# Altium project RTU v1.4.PrjPcb (part 1 of 2)
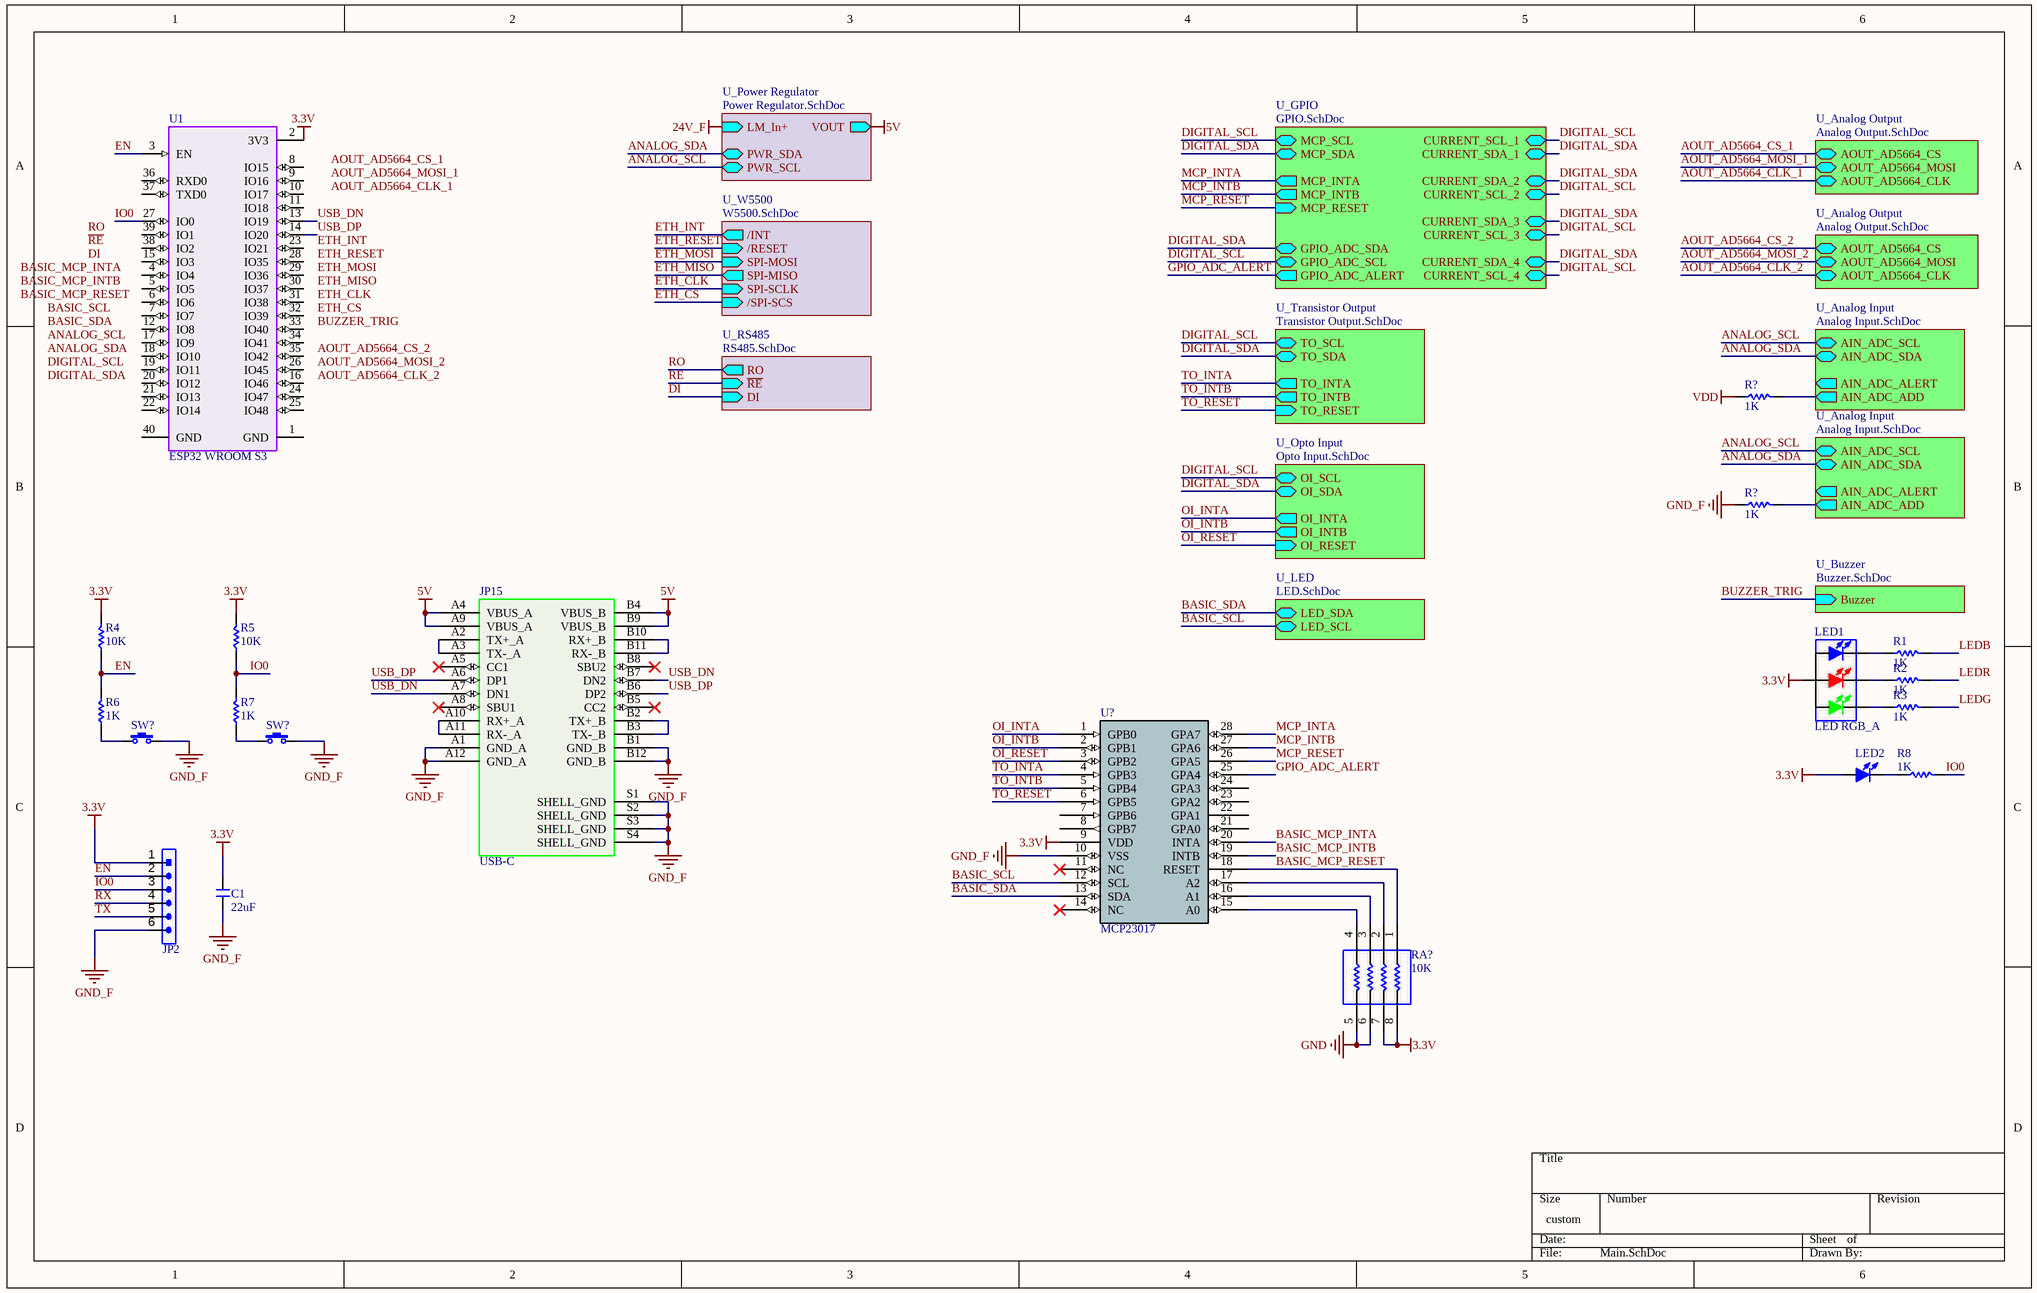
[diagram p0: Main.SchDoc]
12 sheets, 494 parts. Net scope: hierarchical (ports join the sheet entries above them; power ports are global).
Board file: RTU PCB v1.4.PcbDoc
Sheets:
  Main.SchDoc
    U_RS485 = RS485.SchDoc
    U_Power Regulator = Power Regulator.SchDoc
    U_W5500 = W5500.SchDoc
    U_Analog Input = Analog Input.SchDoc
    U_Analog Input = Analog Input.SchDoc
    U_Analog Output = Analog Output.SchDoc
    U_Analog Output = Analog Output.SchDoc
    U_Transistor Output = Transistor Output.SchDoc
    U_GPIO = GPIO.SchDoc
      U_GPIO SUB = GPIO SUB.SchDoc
      U_GPIO SUB = GPIO SUB.SchDoc
      U_GPIO SUB = GPIO SUB.SchDoc
      U_GPIO SUB = GPIO SUB.SchDoc
    U_Opto Input = Opto Input.SchDoc
    U_Buzzer = Buzzer.SchDoc
    U_LED = LED.SchDoc

## Sheet Main.SchDoc
size 381 x 241 mm; SheetNumber: 1; SheetTotal: 11

### Parts
(Parts that share a designator on the sheet are numbered #1, #2 ... from top to bottom, then left to right.)
C1  22uF  [C 0805]
JP2  HDR-1X6  [HDR-1X6]  (value not drawn)
JP15  USB-C  [USB-C-RIGHT]
LED1  LED RGB_A  [RGB-0805-A]
LED2  LED-SMD  [LED 0805B]  (value not drawn)
R1  1K  [R 0805]
R2  1K  [R 0805]
R3  1K  [R 0805]
R4  10K  [R 0805]
R5  10K  [R 0805]
R6  1K  [R 0805]
R7  1K  [R 0805]
R8  1K  [R 0805]
R?#1  1K  [R 0805]
R?#2  1K  [R 0805]
RA?#1  10K  [RA1206 (4x0603)]
SW?#1  SKPMAPE010-6X6  [SKPMAPE010]  (value not drawn)
SW?#2  SKPMAPE010-6X6  [SKPMAPE010]  (value not drawn)
U1  ESP32 WROOM S3  [ESP32 WROOM S3]
U?#1  MCP23017  [SOIC28]

### Sub-sheets
U_Analog Input = Analog Input.SchDoc: AIN_ADC_SCL (bidir), AIN_ADC_SDA (bidir), AIN_ADC_ALERT (out), AIN_ADC_ADD (out)
U_Analog Input = Analog Input.SchDoc: AIN_ADC_SCL (bidir), AIN_ADC_SDA (bidir), AIN_ADC_ALERT (out), AIN_ADC_ADD (out)
U_Analog Output = Analog Output.SchDoc: AOUT_AD5664_CS (bidir), AOUT_AD5664_MOSI (bidir), AOUT_AD5664_CLK (bidir)
U_Analog Output = Analog Output.SchDoc: AOUT_AD5664_CS (bidir), AOUT_AD5664_MOSI (bidir), AOUT_AD5664_CLK (bidir)
U_Buzzer = Buzzer.SchDoc: Buzzer (in)
U_GPIO = GPIO.SchDoc: GPIO_ADC_ALERT (out), MCP_INTA (out), MCP_INTB (out), MCP_RESET (in), MCP_SCL (bidir), MCP_SDA (bidir), CURRENT_SCL_1 (bidir), CURRENT_SDA_1 (bidir), CURRENT_SDA_2 (bidir), CURRENT_SCL_2 (bidir), CURRENT_SDA_4 (bidir), CURRENT_SCL_4 (bidir), CURRENT_SDA_3 (bidir), CURRENT_SCL_3 (bidir), GPIO_ADC_SDA (bidir), GPIO_ADC_SCL (bidir)
U_LED = LED.SchDoc: LED_SDA (bidir), LED_SCL (bidir)
U_Opto Input = Opto Input.SchDoc: OI_SCL (bidir), OI_SDA (bidir), OI_INTA (out), OI_INTB (out), OI_RESET (in)
U_Power Regulator = Power Regulator.SchDoc: LM_In+ (in), VOUT (out), PWR_SCL (bidir), PWR_SDA (bidir)
U_RS485 = RS485.SchDoc: RO (out), ~{RE} (in), DI (in)
U_Transistor Output = Transistor Output.SchDoc: TO_SCL (bidir), TO_SDA (bidir), TO_INTA (out), TO_INTB (out), TO_RESET (in)
U_W5500 = W5500.SchDoc: /INT (out), /RESET (in), SPI-MOSI (in), SPI-MISO (out), SPI-SCLK (in), /SPI-SCS (in)

### Nets
3.3V: C1.1 JP2.1 LED1.3(RED_A) LED2.1(A) R4.2 R5.2 RA?#1.7 RA?#1.8 U1.2(3V3) U?#1.9(VDD)
5V: JP15.A4(VBUS_A) JP15.A9(VBUS_A) JP15.B4(VBUS_B) JP15.B9(VBUS_B) ; sheet U_Power Regulator/VOUT  [project net VOUT]
GND: RA?#1.5 RA?#1.6
GND_F: C1.2 JP2.6 JP15.A1(GND_A) JP15.A12(GND_A) JP15.B1(GND_B) JP15.B12(GND_B) JP15.S1(SHELL_GND) JP15.S2(SHELL_GND) JP15.S3(SHELL_GND) JP15.S4(SHELL_GND) R?#2.1 SW?#1.2 SW?#2.2 U?#1.10(VSS)
VDD: R?#1.1
ANALOG_SCL: sheet U_Power Regulator/PWR_SCL, sheet U_Analog Input/AIN_ADC_SCL, sheet U_Analog Input/AIN_ADC_SCL
ANALOG_SDA: sheet U_Power Regulator/PWR_SDA, sheet U_Analog Input/AIN_ADC_SDA, sheet U_Analog Input/AIN_ADC_SDA
BASIC_MCP_INTA: U?#1.20(INTA)
BASIC_MCP_INTB: U?#1.19(INTB)
BASIC_MCP_RESET: RA?#1.1 U?#1.18(RESET)
BASIC_SCL: U?#1.12(SCL) ; sheet U_LED/LED_SCL
BASIC_SDA: U?#1.13(SDA) ; sheet U_LED/LED_SDA
DIGITAL_SCL: sheet U_Transistor Output/TO_SCL, sheet U_GPIO/MCP_SCL, sheet U_GPIO/CURRENT_SCL_1, sheet U_GPIO/CURRENT_SCL_2, sheet U_GPIO/CURRENT_SCL_4, sheet U_GPIO/CURRENT_SCL_3, sheet U_GPIO/GPIO_ADC_SCL, sheet U_Opto Input/OI_SCL
DIGITAL_SDA: sheet U_Transistor Output/TO_SDA, sheet U_GPIO/MCP_SDA, sheet U_GPIO/CURRENT_SDA_1, sheet U_GPIO/CURRENT_SDA_2, sheet U_GPIO/CURRENT_SDA_4, sheet U_GPIO/CURRENT_SDA_3, sheet U_GPIO/GPIO_ADC_SDA, sheet U_Opto Input/OI_SDA
EN: JP2.2 R4.1 R6.2 U1.3(EN)
GPIO_ADC_ALERT: U?#1.25(GPA4) ; sheet U_GPIO/GPIO_ADC_ALERT
IO0: JP2.3 R5.1 R7.2 R8.2 U1.27(IO0)
LEDB: R1.2
LEDG: R3.2
LEDR: R2.2
MCP_INTA: U?#1.28(GPA7) ; sheet U_GPIO/MCP_INTA
MCP_INTB: U?#1.27(GPA6) ; sheet U_GPIO/MCP_INTB
MCP_RESET: U?#1.26(GPA5) ; sheet U_GPIO/MCP_RESET
OI_INTA: U?#1.1(GPB0) ; sheet U_Opto Input/OI_INTA
OI_INTB: U?#1.2(GPB1) ; sheet U_Opto Input/OI_INTB
OI_RESET: U?#1.3(GPB2) ; sheet U_Opto Input/OI_RESET
RX: JP2.4
TO_INTA: U?#1.4(GPB3) ; sheet U_Transistor Output/TO_INTA
TO_INTB: U?#1.5(GPB4) ; sheet U_Transistor Output/TO_INTB
TO_RESET: U?#1.6(GPB5) ; sheet U_Transistor Output/TO_RESET
TX: JP2.5
USB_DN: JP15.A7(DN1) JP15.B7(DN2) U1.13(IO19)
USB_DP: JP15.A6(DP1) JP15.B6(DP2) U1.14(IO20)
NetJP15_A2: JP15.A2(TX+_A) JP15.A3(TX-_A)
NetJP15_A10: JP15.A10(RX+_A) JP15.A11(RX-_A)
NetJP15_B2: JP15.B2(TX+_B) JP15.B3(TX-_B)
NetJP15_B10: JP15.B10(RX+_B) JP15.B11(RX-_B)
NetLED1_1: LED1.1(BULE_K) R1.1
NetLED1_2: LED1.2(GREEN_K) R3.1
NetLED1_4: LED1.4(RED_K) R2.1
NetLED2_2: LED2.2(K) R8.1
NetR6_1: R6.1 SW?#1.1
NetR7_1: R7.1 SW?#2.1
NetR?#1_2: R?#1.2 ; sheet U_Analog Input/AIN_ADC_ADD
NetR?#2_2: R?#2.2 ; sheet U_Analog Input/AIN_ADC_ADD
NetRA?#1_2: RA?#1.2 U?#1.17(A2)
NetRA?#1_3: RA?#1.3 U?#1.16(A1)
NetRA?#1_4: RA?#1.4 U?#1.15(A0)

Not connected (* = marked no-connect by the designer): JP15 A5(CC1)* A8(SBU1)* B5(CC2)* B8(SBU2)*; U1 1(GND) 4(IO4) 5(IO5) 6(IO6) 7(IO7) 8(IO15) 9(IO16) 10(IO17) 11(IO18) 12(IO8) 15(IO3) 16(IO46) 17(IO9) 18(IO10) 19(IO11) 20(IO12) 21(IO13) 22(IO14) 23(IO21) 24(IO47) 25(IO48) 26(IO45) 28(IO35) 29(IO36) 30(IO37) 31(IO38) 32(IO39) 33(IO40) 34(IO41) 35(IO42) 36(RXD0) 37(TXD0) 38(IO2) 39(IO1) 40(GND); U?#1 7(GPB6) 8(GPB7) 11(NC)* 14(NC)* 21(GPA0) 22(GPA1) 23(GPA2) 24(GPA3)

### Notes on the sheet
- Labels drawn without touching a wire or pin: ANALOG_SCL, ANALOG_SDA, AOUT_AD5664_CLK_1, AOUT_AD5664_CLK_2, AOUT_AD5664_CS_1, AOUT_AD5664_CS_2, AOUT_AD5664_MOSI_1, AOUT_AD5664_MOSI_2, BASIC_MCP_INTA, BASIC_MCP_INTB, BASIC_MCP_RESET, BASIC_SCL, BASIC_SDA, BUZZER_TRIG, DI, DIGITAL_SCL, DIGITAL_SDA, ETH_CLK, ETH_CS, ETH_INT, ETH_MISO, ETH_MOSI, ETH_RESET, RO, ~{RE}

### Library data of the parts
C1 = C: Non-polar patch capacitor; BOM名称: 无极性贴片电容; 版权归属: 源创客; 学习资源: www.ooocke.com
JP2 = Header 6: 6P Connector; BOM名称: 6P接插件; 版权归属: 源创客; 学习资源: www.ooocke.com
JP15 = USB-C-RIGHT
LED2 = LED-SMD: Patch LED; BOM名称: 贴片LED; 版权归属: 源创客; 学习资源: www.ooocke.com
R1-R8 R?#1 R?#2 = R: Chip resistor; 版权归属: 源创客; BOM名称: Chip resistor; 学习资源: www.ooocke.com
RA?#1 = R-ARR: 4 way Chip Resistor Array
SW?#1 SW?#2 = SKPMAPE010-6X6: Carbon Tactile

## Sheet RS485.SchDoc
size A4; SheetNumber: 7; SheetTotal: 8
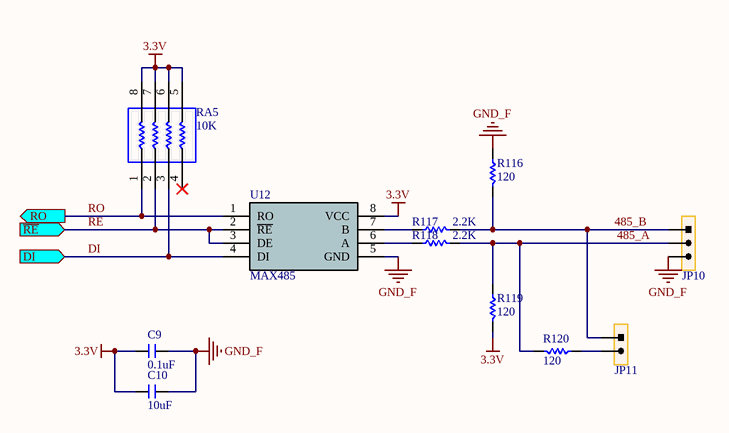
[diagram p1: RS485.SchDoc]

### Parts
C9  0.1uF  [C 0805]
C10  10uF  [C 0805]
JP10  HDR-1X3  [KF2EDGK-3P_H_5.08]  (value not drawn)
JP11  HDR-1X2  [HDR-1X2]  (value not drawn)
R116  120  [R 0805]
R117  2.2K  [R 0805]
R118  2.2K  [R 0805]
R119  120  [R 0805]
R120  120  [R 0805]
RA5  10K  [RA1206 (4x0603)]
U12  MAX485  [SOP8_N]

### Ports
DI (in), RO (out), ~{RE} (in)

### Nets
3.3V: C9.1 C10.1 R119.2 RA5.5 RA5.6 RA5.7 RA5.8 U12.8(VCC)
GND_F: C9.2 C10.2 JP10.3 R116.1 U12.5(GND)
485_A: JP10.2 R118.2 R119.1 R120.2
485_B: JP10.1 JP11.1 R116.2 R117.2
DI: RA5.3 U12.4(DI) ; port DI
~{RE}: RA5.2 U12.2(~{RE}) U12.3(DE) ; port ~{RE}
RO: RA5.1 U12.1(RO) ; port RO
NetJP11_2: JP11.2 R120.1
NetR117_1: R117.1 U12.7(B)
NetR118_1: R118.1 U12.6(A)

Not connected (* = marked no-connect by the designer): RA5 4*

### Library data of the parts
C9 C10 = C: as C1 on sheet Main; 学习资源: www.ooocke.com
JP10 = Header 3: 3P Connector; BOM名称: 3P接插件; 版权归属: 源创客; 学习资源: www.ooocke.com
JP11 = Header 2: 2P Connector; BOM名称: 2P接插件; 版权归属: 源创客; 学习资源: www.ooocke.com
R116-R120 = R: Chip resistor; 版权归属: 源创客; BOM名称: Chip resistor; 学习资源: www.ooocke.com
RA5 = R-ARR: 4 way Chip Resistor Array
U12 = MAX485: RS485/RS422 Transceivers; BOM名称: MAX232; 版权归属: 源创客; 学习资源: www.ooocke.com

## Sheet Power Regulator.SchDoc
size A4; SheetNumber: 2; SheetTotal: 9
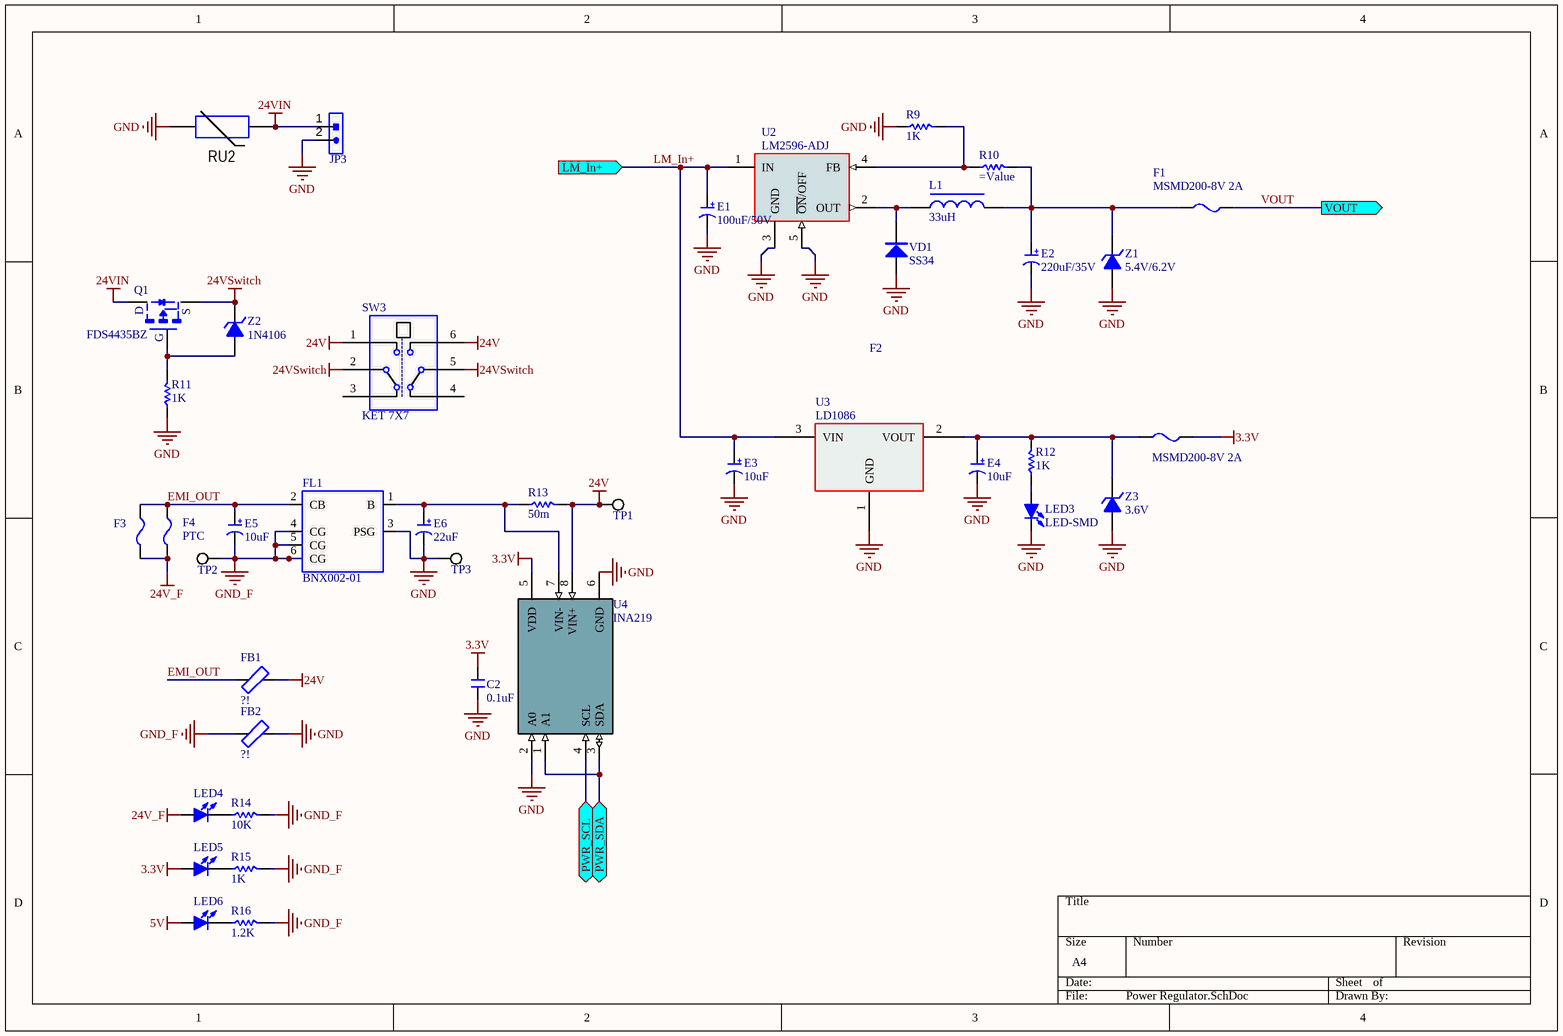
[diagram p2: Power Regulator.SchDoc]

### Parts
C2  0.1uF  [C 0805]
E1  100uF/50V  [CM C(5*5.4)]
E2  220uF/35V  [CM C(5*5.4)]
E3  10uF  [CM C(5*5.4)]
E4  10uF  [CM C(5*5.4)]
E5  10uF  [CM D(6.3*7.7)]
E6  22uF  [CM D(6.3*7.7)]
F1  MSMD200-8V 2A  [FU 0805]
F2  MSMD200-8V 2A  [FU 0805]
F3  MSMD200-8V 2A  [FU 1206]  (value not drawn)
F4  PTC  [PTC]
FB1  ?!  [F 1206]
FB2  ?!  [F 1206]
FL1  BNX002-01  [FIL_BNX002-01]
JP3  HDR-1X2  [KF2EDGK-2P_H_7.62]  (value not drawn)
L1  33uH  [CD53]
LED3  LED-SMD  [LED 0805R]
LED4  LED-SMD  [LED 0805R]  (value not drawn)
LED5  LED-SMD  [LED 0805R]  (value not drawn)
LED6  LED-SMD  [LED 0805R]  (value not drawn)
Q1  FDS4435BZ  [SOP8-E3]
R9  1K  [R 0805]
R10  (no value)  [R 0805]
R11  1K  [R 0805]
R12  1K  [R 0805]
R13  50m  [R 1812]
R14  10K  [R 0805]
R15  1K  [R 0805]
R16  1.2K  [R 0805]
RU2  *  [Varistor Short Hieght - Straight]  (value not drawn)
SW3  KET 7X7  [KFT DIP-7X7]
TP1  Test Point Pad  [TP15]  (value not drawn)
TP2  Test Point Pad  [TP15]  (value not drawn)
TP3  Test Point Pad  [TP15]  (value not drawn)
U2  LM2596-ADJ  [TO263-5A]
U3  LD1086  [TO252]
U4  INA219  [SOT23-8]
VD1  SS34  [SMA]
Z1  5.4V/6.2V  [DO-213AA]
Z2  1N4106  [DO-213AA]
Z3  3.6V  [DO-213AA]

### Ports
LM_In+ (in), PWR_SCL (bidir), PWR_SDA (bidir), VOUT (out)

### Nets
3.3V: C2.2 F2.2 LED5.1(A) U4.5(VDD)
24V: FB1.2 R13.2 SW3.1 SW3.6 TP1.1 U4.8(VIN+)
24VIN: JP3.1 Q1.5-8(D) RU2.2
24VSwitch: Q1.1-3(S) SW3.2 SW3.5 Z2.2(K)
GND: C2.1 E1.2(K) E2.2(K) E3.2(K) E4.2(K) E6.2(K) FB2.2 FL1.3(PSG) JP3.2 LED3.2(K) R9.1 R11.1 RU2.1 TP3.1 U2.3(GND) U2.5(~{ON}/OFF) U3.1(GND) U4.2(A0) U4.6(GND) VD1.1(A) Z1.1(A) Z3.1(A)
GND_F: E5.2(K) FB2.1 FL1.4(CG) FL1.5(CG) FL1.6(CG) R14.2 R15.2 R16.2 TP2.1
LM_In+: E1.1(A) E3.1(A) F3.1 F4.1 LED4.1(A) U2.1(IN) U3.3(VIN) ; port LM_In+  [also labelled 24V_F]
VOUT: F1.2 LED6.1(A) ; port VOUT  [also labelled 5V]
ANALOG_SCL: U4.4(SCL) ; port PWR_SCL
ANALOG_SDA: U4.1(A1) U4.3(SDA) ; port PWR_SDA
EMI_OUT: E5.1(A) F3.2 F4.2 FB1.1 FL1.2(CB)
NetE2_1: E2.1(A) F1.1 L1.2 R10.2 Z1.2(K)
NetE4_1: E4.1(A) F2.1 R12.2 U3.2(VOUT) Z3.2(K)
NetE6_1: E6.1(A) FL1.1(B) R13.1 U4.7(VIN-)
NetL1_1: L1.1 U2.2(OUT) VD1.2(K)
NetLED3_1: LED3.1(A) R12.1
NetLED4_2: LED4.2(K) R14.1
NetLED5_2: LED5.2(K) R15.1
NetLED6_2: LED6.2(K) R16.1
NetQ1_4: Q1.4(G) R11.2 Z2.1(A)
NetR9_2: R9.2 R10.1 U2.4(FB)

Not connected (* = marked no-connect by the designer): SW3 3 4

### Notes on the sheet
- (in symbol C-CM) +
- (in symbol KET 7X7) ---------------

### Library data of the parts
C2 = C: as C1 on sheet Main; 学习资源: www.ooocke.com
E1-E6 = C-CM: Chip electrolytic capacitor; BOM名称: 贴片电解电容; 版权归属: 源创客; 学习资源: www.ooocke.com
F1-F3 = FU: Chip fuse; BOM名称: 贴片保险丝; 版权归属: 源创客; 学习资源: www.ooocke.com
FB1 FB2 = FB: Ferrite Bead; BOM名称: 贴片电阻; 版权归属: 源创客; 学习资源: www.ooocke.com
FL1 = BNX002-01: LC EMI Filter 5th Order Low Pass 2 Channel 10A Block, 4 Lead; MF: Murata; Package: Block-4 Murata; Price: None; SnapEDA_Link: https://www.snapeda.com/parts/BNX002-01/Murata%20Electronics%20North%20America/view-part/12269/?ref=snap; Availability: Unavailable; Value: *; MP: BNX002-01
JP3 = Header 2: 2P Connector; BOM名称: 2P接插件; 版权归属: 源创客; 学习资源: www.ooocke.com
L1 = L-CD: Chip power inductor; BOM名称: 功率电感; 版权归属: 源创客; 学习资源: www.ooocke.com
LED3-LED6 = LED-SMD: Patch LED; BOM名称: 贴片LED; 版权归属: 源创客; 学习资源: www.ooocke.com
R9-R16 = R: Chip resistor; 版权归属: 源创客; BOM名称: Chip resistor; 学习资源: www.ooocke.com
RU2 = V: Versiror; Manufacturer: *; Model: *; HelpURL: *; ComponentKind: *; Value: *
SW3 = KET 7X7: 7*7 switch; BOM名称: 7*7开关; 版权归属: 源创客; 学习资源: www.ooocke.com
TP1-TP3 = Test Point Pad: Company: SJ Libraries; Designer: Eng. Saeid Jorablo; Rule: UNIONINDEX=0|RULEKIND=ComponentClearance|NETSCOPE=AnyNet|LAYERKIND=SameLayer|NAME=Schematic Component Clearance Constraint|GAP=0mil|COLLISIONCHECKMODE=3|VERTICALGAP=0mil|SHOWDISTANCES=FALSE|UNIT=Imperial; Mounting Technology: Surface Mount\Through-Hole; ComponentLink1Description: Datasheet; Pin Count: 0; Update Date: 6/3/2012; Category: MISC; HelpURL: http://s3.picofile.com/file/7443264187/Coming_Soon_logo.gif
U2 = LM2596: DC step-down chip; BOM名称: DC稳压芯片; 版权归属: 源创客; 学习资源: www.ooocke.com
U3 = LD1086: Linear Voltage Regulator IC 1 Output 1.5A DPAK
VD1 = SS34: Schottky diodes; BOM名称: 肖特基二极管; 版权归属: 源创客; 属性: 40V/3A; 学习资源: www.ooocke.com
Z1-Z3 = 1N4106: 12V/0.5W voltage regulator; BOM名称: 12V/0.5W稳压管; 版权归属: 源创客; 学习资源: www.ooocke.com

## Sheet W5500.SchDoc
size A4; SheetNumber: 5; SheetTotal: 8
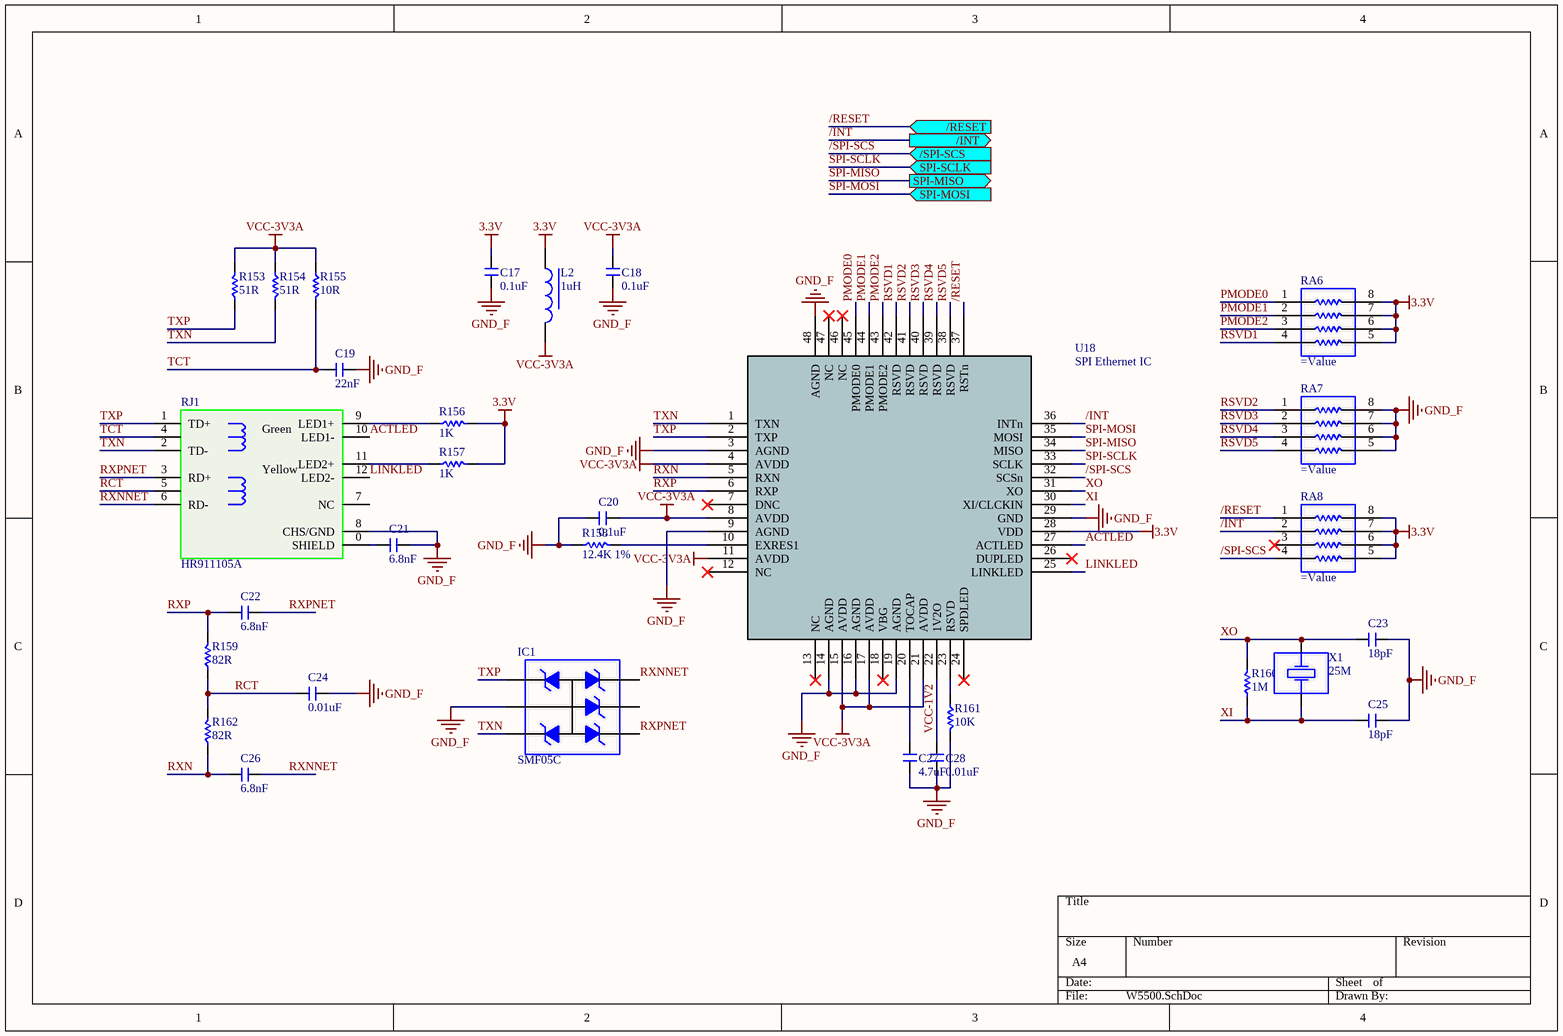
[diagram p3: W5500.SchDoc]

### Parts
C17  0.1uF  [C 0805]
C18  0.1uF  [C 0805]
C19  22nF  [C 0805]
C20  0.1uF  [C 0805]
C21  6.8nF  [C 0805]
C22  6.8nF  [C 0805]
C23  18pF  [C 0805]
C24  0.01uF  [C 0805]
C25  18pF  [C 0805]
C26  6.8nF  [C 0805]
C27  4.7uF  [C 0805]
C28  0.01uF  [C 0805]
IC1  SMF05C  [SOT23-6L]
L2  1uH  [L 0805]
R153  51R  [R 0805]
R154  51R  [R 0805]
R155  10R  [R 0805]
R156  1K  [R 0805]
R157  1K  [R 0805]
R158  12.4K 1%  [R 0805]
R159  82R  [R 0805]
R160  1M  [R 0805]
R161  10K  [R 0805]
R162  82R  [R 0805]
RA6  (no value)  [RA1206 (4x0603)]
RA7  (no value)  [RA1206 (4x0603)]
RA8  (no value)  [RA1206 (4x0603)]
RJ1  HR911105A  [RJ-45A12]
U18  SPI Ethernet IC  [LQFP48 7X7_L]
X1  25M  [XTAL-HC49S-THD]

### Ports
/INT (out), /RESET (in), /SPI-SCS (in), SPI-MISO (out), SPI-MOSI (in), SPI-SCLK (in)

### Nets
3.3V: C17.2 L2.1 R156.2 R157.2 RA6.5 RA6.6 RA6.7 RA6.8 RA8.5 RA8.6 RA8.7 RA8.8 U18.28(VDD)
GND_F: C17.1 C18.1 C19.2 C20.1 C21.2 C23.2 C24.2 C25.2 C27.2 C28.2 IC1.2(A) R158.1 R161.2 RA7.5 RA7.6 RA7.7 RA7.8 RJ1.8(CHS/GND) U18.3(AGND) U18.9(AGND) U18.14(AGND) U18.16(AGND) U18.19(AGND) U18.29(GND) U18.48(AGND)
VCC-3V3A: C18.2 C20.2 L2.2 R153.2 R154.1 R155.1 U18.4(AVDD) U18.8(AVDD) U18.11(AVDD) U18.15(AVDD) U18.17(AVDD) U18.21(AVDD)
/INT: RA8.2 U18.36(INTn) ; port /INT
/RESET: RA8.1 U18.37(RSTn) ; port /RESET
/SPI-SCS: RA8.4 U18.32(SCSn) ; port /SPI-SCS
ACTLED: RJ1.10(LED1-) U18.27(ACTLED)
LINKLED: RJ1.12(LED2-) U18.25(LINKLED)
PMODE0: RA6.1 U18.45(PMODE0)
PMODE1: RA6.2 U18.44(PMODE1)
PMODE2: RA6.3 U18.43(PMODE2)
RCT: C24.1 R159.1 R162.2 RJ1.5
RSVD1: RA6.4 U18.42(RSVD)
RSVD2: RA7.1 U18.41(RSVD)
RSVD3: RA7.2 U18.40(RSVD)
RSVD4: RA7.3 U18.39(RSVD)
RSVD5: RA7.4 U18.38(RSVD)
RXN: C26.1 R162.1 U18.5(RXN)
RXNNET: C26.2 IC1.4(K) RJ1.6(RD-)
RXP: C22.1 R159.2 U18.6(RXP)
RXPNET: C22.2 IC1.6(K) RJ1.3(RD+)
SPI-MISO: U18.34(MISO) ; port SPI-MISO  [project net ETH_MISO]
SPI-MOSI: U18.35(MOSI) ; port SPI-MOSI  [project net ETH_MOSI]
SPI-SCLK: U18.33(SCLK) ; port SPI-SCLK  [project net ETH_CLK]
TCT: C19.1 R155.2 RJ1.4
TXN: IC1.3(K) R154.2 RJ1.2(TD-) U18.1(TXN)
TXP: IC1.1(K) R153.1 RJ1.1(TD+) U18.2(TXP)
VCC-1V2: C28.1 U18.22(1V2O)
XI: C25.1 R160.1 U18.30(XI/CLCKIN) X1.1
XO: C23.1 R160.2 U18.31(XO) X1.2
NetC21_1: C21.1 RJ1.0(SHIELD)
NetC27_1: C27.1 U18.20(TOCAP)
NetR156_1: R156.1 RJ1.9(LED1+)
NetR157_1: R157.1 RJ1.11(LED2+)
NetR158_2: R158.2 U18.10(EXRES1)
NetR161_1: R161.1 U18.23(RSVD)

Not connected (* = marked no-connect by the designer): IC1 5(K); RA8 3*; RJ1 7(NC); U18 7(DNC)* 12(NC)* 13(NC)* 18(VBG)* 24(SPDLED)* 26(DUPLED)* 46(NC)* 47(NC)*

### Notes on the sheet
- (in symbol HR911105A) Green; Yellow

### Library data of the parts
C17-C28 = C: as C1 on sheet Main; 学习资源: www.ooocke.com
IC1 = SMF05C: ESD Protection Diode Array, 5-Line
L2 = L: Low power chip inductor; BOM名称: 小功率贴片电感; 版权归属: 源创客; 学习资源: www.ooocke.com
R153-R162 = R: Chip resistor; 版权归属: 源创客; BOM名称: Chip resistor; 学习资源: www.ooocke.com
RA6-RA8 = R-ARR: 4 way Chip Resistor Array
RJ1 = HR911105A: Illuminated Ethernet interface; BOM名称: 带灯以太网接口; 版权归属: 源创客; 学习资源: www.ooocke.com
U18 = W5500
X1 = XTAL-2: 2-Pin crystal; BOM名称: 2脚晶振; 版权归属: 源创客; 学习资源: www.ooocke.com

## Sheet Analog Input.SchDoc
size A4; SheetNumber: 6; SheetTotal: 10
Used 2 times, as channels U_Analog Input, U_Analog Input. Parts and nets are listed once, with the designators drawn on the sheet.
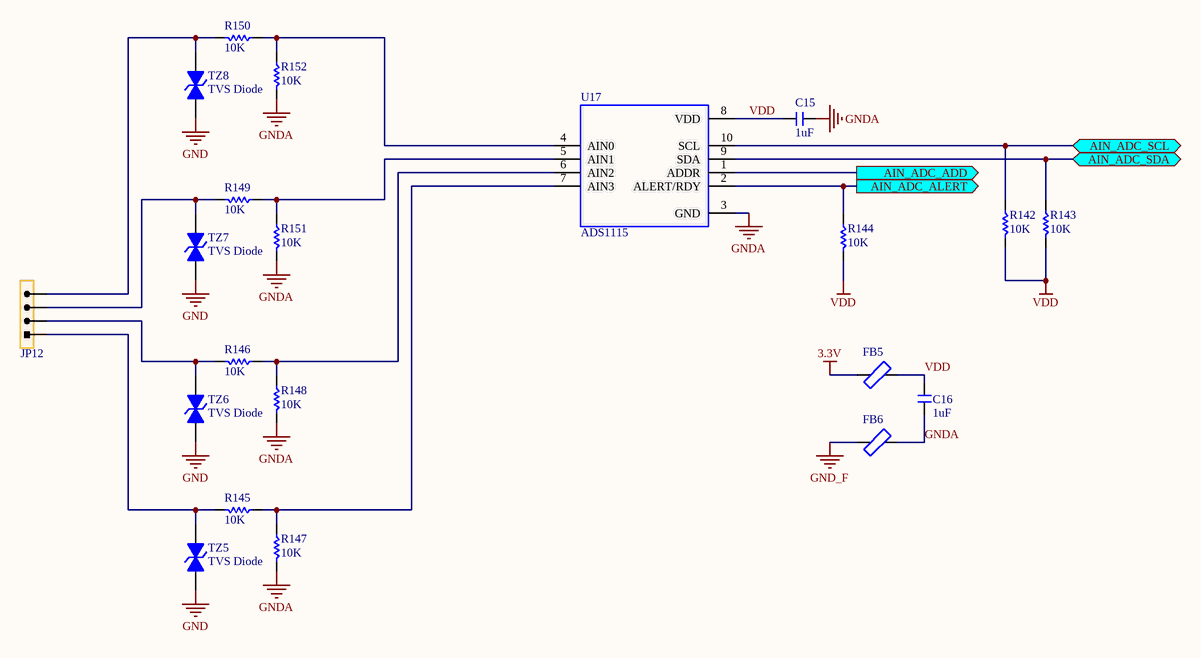
[diagram p4: Analog Input.SchDoc]

### Parts
C15  1uF  [C 0805]
C16  1uF  [C 0805]
FB5  (no value)  [F 0805]
FB6  (no value)  [F 0805]
JP12  HDR-1X4  [KF-4P-BLK-H-3.81]  (value not drawn)
R142  10K  [R 0805]
R143  10K  [R 0805]
R144  10K  [R 0805]
R145  10K  [R 0805]
R146  10K  [R 0805]
R147  10K  [R 0805]
R148  10K  [R 0805]
R149  10K  [R 0805]
R150  10K  [R 0805]
R151  10K  [R 0805]
R152  10K  [R 0805]
TZ5  TVS Diode  [SMB]
TZ6  TVS Diode  [SMB]
TZ7  TVS Diode  [SMB]
TZ8  TVS Diode  [SMB]
U17  ADS1115  [VSSOP10-N]

### Ports
AIN_ADC_ADD (out), AIN_ADC_ALERT (out), AIN_ADC_SCL (bidir), AIN_ADC_SDA (bidir)

### Nets
3.3V: FB5.1
GND: TZ5.1(A) TZ6.1(A) TZ7.1(A) TZ8.1(A)
GND_F: FB6.1
GNDA: C15.1 C16.1 FB6.2 R147.2 R148.2 R151.2 R152.2 U17.3(GND)
VDD: C15.2 C16.2 FB5.2 R142.2 R143.2 R144.2 U17.8(VDD)
AIN_ADC_ADD: U17.1(ADDR) ; port AIN_ADC_ADD
AIN_ADC_ALERT: R144.1 U17.2(ALERT/RDY) ; port AIN_ADC_ALERT
AIN_ADC_SCL: R142.1 U17.10(SCL) ; port AIN_ADC_SCL
AIN_ADC_SDA: R143.1 U17.9(SDA) ; port AIN_ADC_SDA
NetJP12_1: JP12.1 R145.2 TZ5.2(K)
NetJP12_2: JP12.2 R146.2 TZ6.2(K)
NetJP12_3: JP12.3 R149.2 TZ7.2(K)
NetJP12_4: JP12.4 R150.2 TZ8.2(K)
NetR145_1: R145.1 R147.1 U17.7(AIN3)
NetR146_1: R146.1 R148.1 U17.6(AIN2)
NetR149_1: R149.1 R151.1 U17.5(AIN1)
NetR150_1: R150.1 R152.1 U17.4(AIN0)

### Channels
U_Analog Input: designators end in _U_Analog_Input#1; ports AIN_ADC_ADD=NetR?#1_2 AIN_ADC_ALERT=NetR144_U_Analog_Input#1_1 AIN_ADC_SCL=ANALOG_SCL AIN_ADC_SDA=ANALOG_SDA
U_Analog Input: designators end in _U_Analog_Input#2; ports AIN_ADC_ADD=NetR?#2_2 AIN_ADC_ALERT=NetR144_U_Analog_Input#2_1 AIN_ADC_SCL=ANALOG_SCL AIN_ADC_SDA=ANALOG_SDA

### Library data of the parts
C15 C16 = C: as C1 on sheet Main; 学习资源: www.ooocke.com
FB5 FB6 = FB: Ferrite Bead; BOM名称: 贴片电阻; 版权归属: 源创客; 学习资源: www.ooocke.com
JP12 = Header 4: 4P Connector; BOM名称: 4P接插件; 版权归属: 源创客; 学习资源: www.ooocke.com
R142-R152 = R: Chip resistor; 版权归属: 源创客; BOM名称: Chip resistor; 学习资源: www.ooocke.com
TZ5-TZ8 = SMBJ-CA: Surface Mount TRANSZORB® Transient Voltage Suppressors
U17 = ADS1115: ADS111x Ultra-Small, Low-Power, I / 2C-Compatible, 860-SPS, 16-Bit ADCs / With Internal Reference, Oscillator, and Programmable Comparator; BOM名称: 数字电位器; 版权归属: 源创客; 学习资源: www.ooocke.com

## Sheet Analog Output.SchDoc
size A4; SheetNumber: 3; SheetTotal: 9
Used 2 times, as channels U_Analog Output, U_Analog Output. Parts and nets are listed once, with the designators drawn on the sheet.
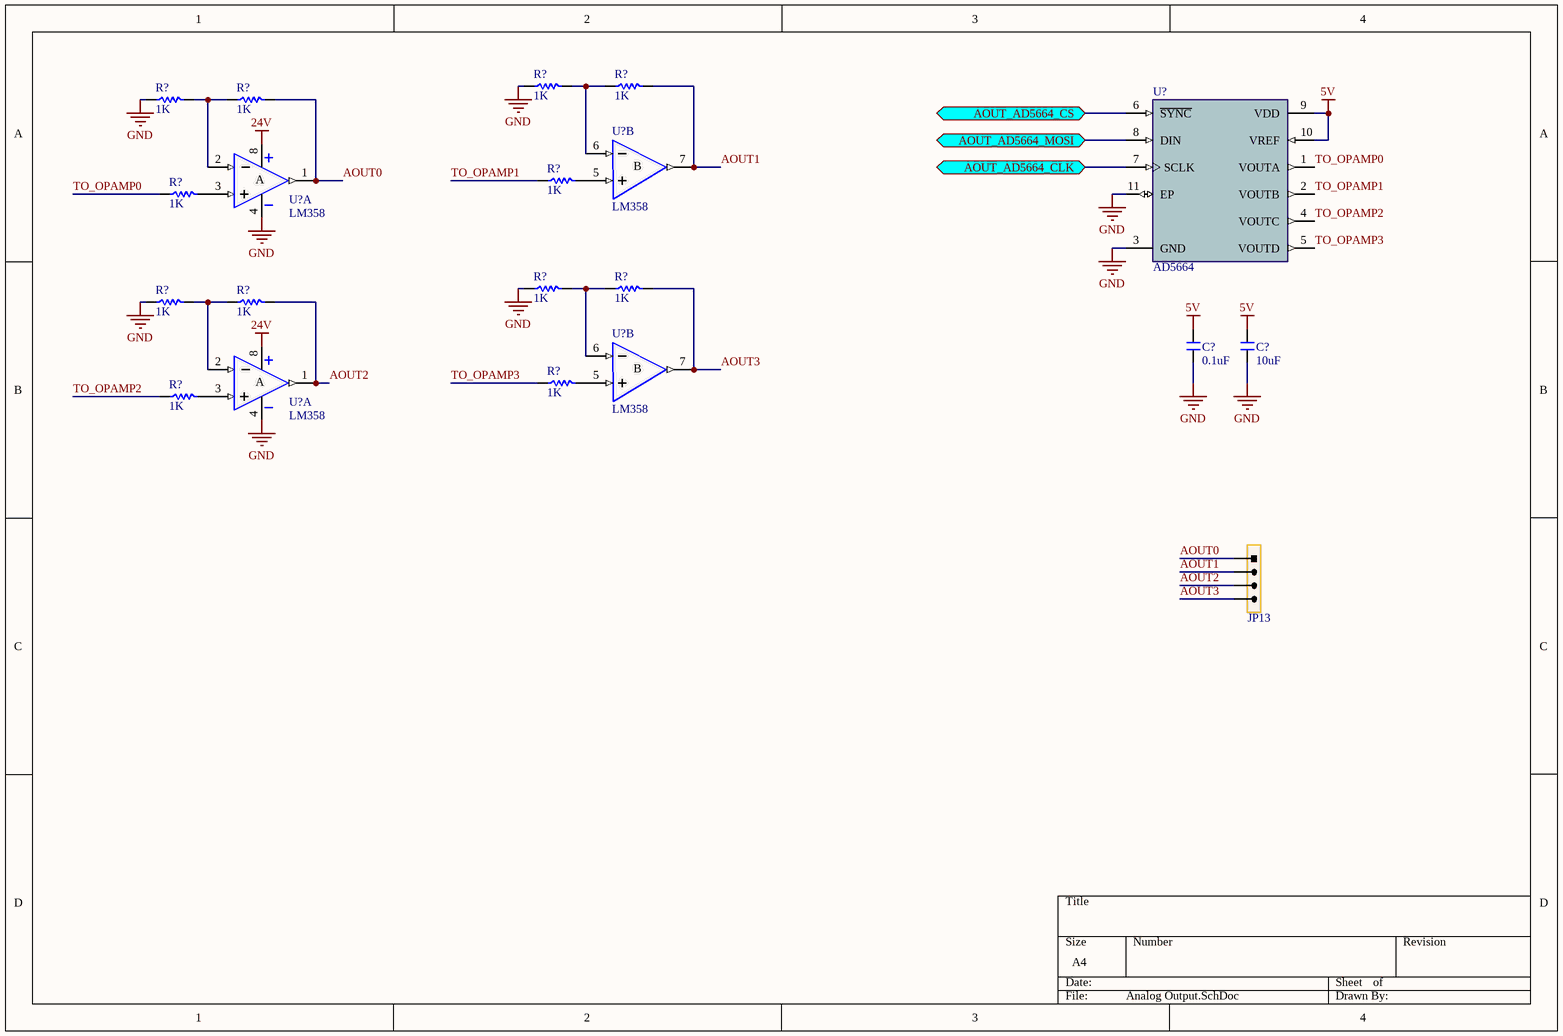
[diagram p5: Analog Output.SchDoc]

### Parts
(Parts that share a designator on the sheet are numbered #1, #2 ... from top to bottom, then left to right.)
C?#1  0.1uF  [C 0805]
C?#2  10uF  [C 0805]
JP13  HDR-1X4  [KF-4P-BLK-H-3.81]  (value not drawn)
R?#1  1K  [R 0805]
R?#2  1K  [R 0805]
R?#3  1K  [R 0805]
R?#4  1K  [R 0805]
R?#5  1K  [R 0805]
R?#6  1K  [R 0805]
R?#7  1K  [R 0805]
R?#8  1K  [R 0805]
R?#9  1K  [R 0805]
R?#10  1K  [R 0805]
R?#11  1K  [R 0805]
R?#12  1K  [R 0805]
U?#1  LM358  [SOP8_N]  (part B of 2)
U?#2  AD5664  [LFCSP -10]
U?#3  LM358  [SOP8_N]  (part A of 2)
U?#4  LM358  [SOP8_N]  (part B of 2)
U?#5  LM358  [SOP8_N]  (part A of 2)

### Ports
AOUT_AD5664_CLK (bidir), AOUT_AD5664_CS (bidir), AOUT_AD5664_MOSI (bidir)

### Nets
5V: C?#1.2 C?#2.2 U?#2.9(VDD) U?#2.10(VREF)
24V: U?#3.8(VCC+) U?#5.8(VCC+)
GND: C?#1.1 C?#2.1 R?#1.1 R?#3.1 R?#7.1 R?#9.1 U?#2.3(GND) U?#2.11(EP) U?#3.4(VCC-) U?#5.4(VCC-)
AOUT0: JP13.1 R?#4.2 U?#3.1(OUT1)
AOUT1: JP13.2 R?#2.2 U?#1.7(OUT2)
AOUT2: JP13.3 R?#10.2 U?#5.1(OUT1)
AOUT3: JP13.4 R?#8.2 U?#4.7(OUT2)
AOUT_AD5664_CLK: U?#2.7(SCLK) ; port AOUT_AD5664_CLK
AOUT_AD5664_CS: U?#2.6(~{SYNC}) ; port AOUT_AD5664_CS
AOUT_AD5664_MOSI: U?#2.8(DIN) ; port AOUT_AD5664_MOSI
TO_OPAMP0: R?#6.1 U?#2.1(VOUTA)
TO_OPAMP1: R?#5.1 U?#2.2(VOUTB)
TO_OPAMP2: R?#12.1 U?#2.4(VOUTC)
TO_OPAMP3: R?#11.1 U?#2.5(VOUTD)
NetR?#1_2: R?#1.2 R?#2.1 U?#1.6(IN2-)
NetR?#3_2: R?#3.2 R?#4.1 U?#3.2(IN1-)
NetR?#5_2: R?#5.2 U?#1.5(IN2+)
NetR?#6_2: R?#6.2 U?#3.3(IN1+)
NetR?#7_2: R?#7.2 R?#8.1 U?#4.6(IN2-)
NetR?#9_2: R?#9.2 R?#10.1 U?#5.2(IN1-)
NetR?#11_2: R?#11.2 U?#4.5(IN2+)
NetR?#12_2: R?#12.2 U?#5.3(IN1+)

### Channels
U_Analog Output: designators C?=C?_U_Analog_Output#1 C?=C?_U_Analog_Output#2 JP13=JP13_U_Analog_Output#1 R?=R?_U_Analog_Output#6 R?=R?_U_Analog_Output#4 R?=R?_U_Analog_Output#3 R?=R?_U_Analog_Output#2 R?=R?_U_Analog_Output#1 R?=R?_U_Analog_Output#5 R?=R?_U_Analog_Output#12 R?=R?_U_Analog_Output#10 R?=R?_U_Analog_Output#9 R?=R?_U_Analog_Output#8 R?=R?_U_Analog_Output#7 R?=R?_U_Analog_Output#11 U?=U?_U_Analog_Output#3 U?=U?_U_Analog_Output#1 U?=U?_U_Analog_Output#5 U?=U?_U_Analog_Output#4 U?=U?_U_Analog_Output#2; ports AOUT_AD5664_CLK=AOUT_AD5664_CLK_1 AOUT_AD5664_CS=AOUT_AD5664_CS_1 AOUT_AD5664_MOSI=AOUT_AD5664_MOSI_1
U_Analog Output: designators C?=C?_U_Analog_Output#3 C?=C?_U_Analog_Output#4 JP13=JP13_U_Analog_Output#2 R?=R?_U_Analog_Output#18 R?=R?_U_Analog_Output#16 R?=R?_U_Analog_Output#15 R?=R?_U_Analog_Output#14 R?=R?_U_Analog_Output#13 R?=R?_U_Analog_Output#17 R?=R?_U_Analog_Output#24 R?=R?_U_Analog_Output#22 R?=R?_U_Analog_Output#21 R?=R?_U_Analog_Output#20 R?=R?_U_Analog_Output#19 R?=R?_U_Analog_Output#23 U?=U?_U_Analog_Output#8 U?=U?_U_Analog_Output#6 U?=U?_U_Analog_Output#10 U?=U?_U_Analog_Output#9 U?=U?_U_Analog_Output#7; ports AOUT_AD5664_CLK=AOUT_AD5664_CLK_2 AOUT_AD5664_CS=AOUT_AD5664_CS_2 AOUT_AD5664_MOSI=AOUT_AD5664_MOSI_2

### Notes on the sheet
- (in symbol LM358, part A) A
- (in symbol LM358, part B) B

### Library data of the parts
C?#1 C?#2 = C: as C1 on sheet Main; 学习资源: www.ooocke.com
JP13 = Header 4: 4P Connector; BOM名称: 4P接插件; 版权归属: 源创客; 学习资源: www.ooocke.com
R?#1-R?#12 = R: Chip resistor; 版权归属: 源创客; BOM名称: Chip resistor; 学习资源: www.ooocke.com
U?#1 U?#3-U?#5 = LM358: Dual op amp; BOM名称: 双路运放; 版权归属: 源创客; 学习资源: www.ooocke.com

## Sheet Transistor Output.SchDoc
size 381 x 241 mm; SheetNumber: 8; SheetTotal: 9
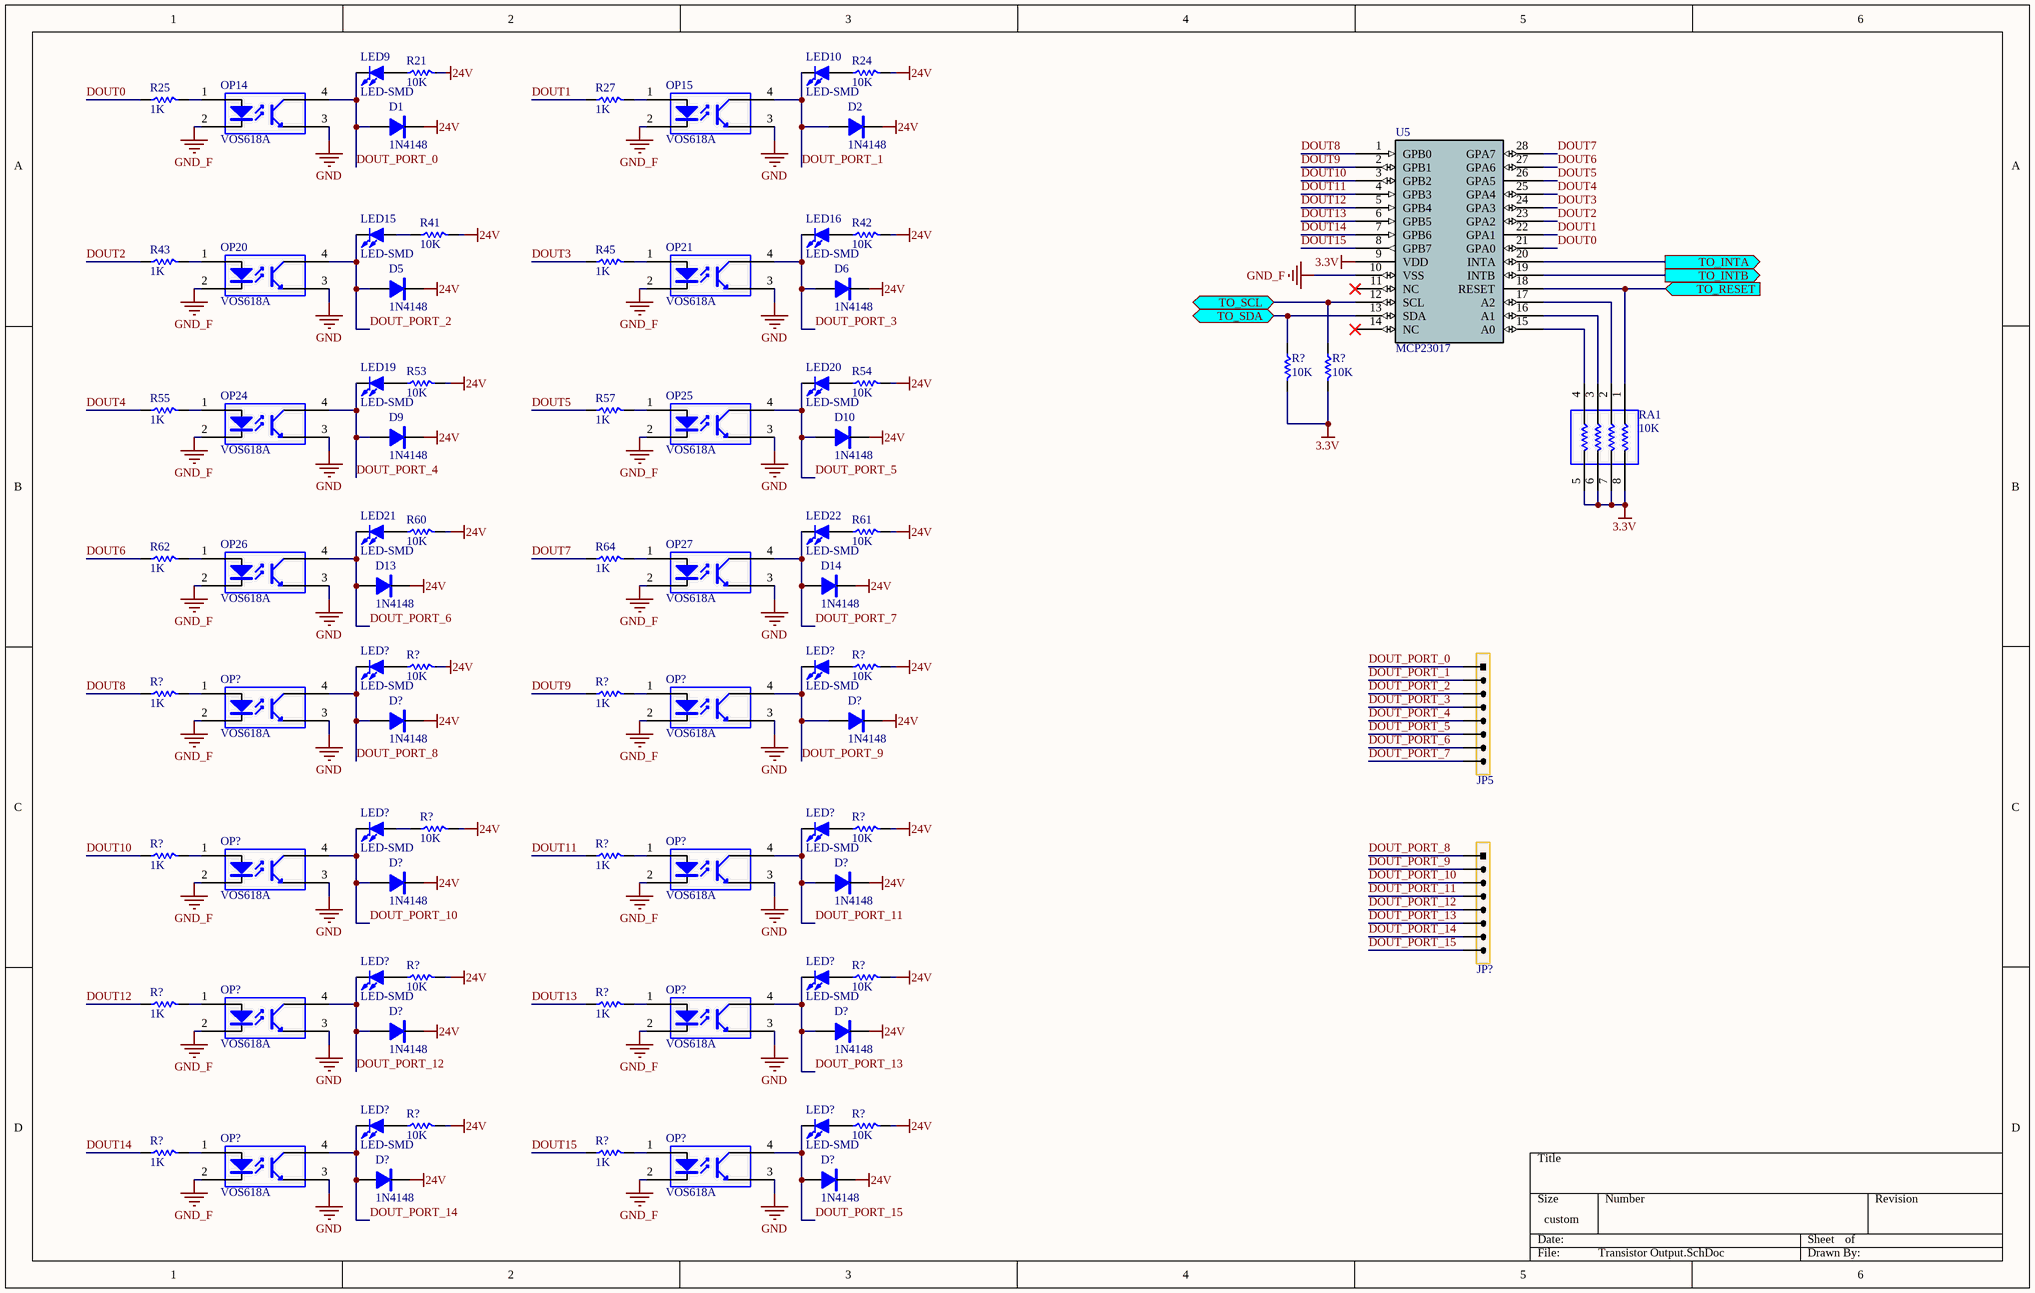
[diagram p6: Transistor Output.SchDoc]

### Parts
(Parts that share a designator on the sheet are numbered #1, #2 ... from top to bottom, then left to right.)
D1  1N4148  [SOD-323]
D2  1N4148  [SOD-323]
D5  1N4148  [SOD-323]
D6  1N4148  [SOD-323]
D9  1N4148  [SOD-323]
D10  1N4148  [SOD-323]
D13  1N4148  [SOD-323]
D14  1N4148  [SOD-323]
D?#1  1N4148  [SOD-323]
D?#2  1N4148  [SOD-323]
D?#3  1N4148  [SOD-323]
D?#4  1N4148  [SOD-323]
D?#5  1N4148  [SOD-323]
D?#6  1N4148  [SOD-323]
D?#7  1N4148  [SOD-323]
D?#8  1N4148  [SOD-323]
JP5  HDR-1X8  [KF-8P-BLK-H-3.81]  (value not drawn)
JP?#1  HDR-1X8  [KF-8P-BLK-H-3.81]  (value not drawn)
LED9  LED-SMD  [LED 0603B]
LED10  LED-SMD  [LED 0603B]
LED15  LED-SMD  [LED 0603B]
LED16  LED-SMD  [LED 0603B]
LED19  LED-SMD  [LED 0603B]
LED20  LED-SMD  [LED 0603B]
LED21  LED-SMD  [LED 0603B]
LED22  LED-SMD  [LED 0603B]
LED?#1  LED-SMD  [LED 0603B]
LED?#2  LED-SMD  [LED 0603B]
LED?#3  LED-SMD  [LED 0603B]
LED?#4  LED-SMD  [LED 0603B]
LED?#5  LED-SMD  [LED 0603B]
LED?#6  LED-SMD  [LED 0603B]
LED?#7  LED-SMD  [LED 0603B]
LED?#8  LED-SMD  [LED 0603B]
OP14  VOS618A  [VOS618A-SSOP4]
OP15  VOS618A  [VOS618A-SSOP4]
OP20  VOS618A  [VOS618A-SSOP4]
OP21  VOS618A  [VOS618A-SSOP4]
OP24  VOS618A  [VOS618A-SSOP4]
OP25  VOS618A  [VOS618A-SSOP4]
OP26  VOS618A  [VOS618A-SSOP4]
OP27  VOS618A  [VOS618A-SSOP4]
OP?#1  VOS618A  [VOS618A-SSOP4]
OP?#2  VOS618A  [VOS618A-SSOP4]
OP?#3  VOS618A  [VOS618A-SSOP4]
OP?#4  VOS618A  [VOS618A-SSOP4]
OP?#5  VOS618A  [VOS618A-SSOP4]
OP?#6  VOS618A  [VOS618A-SSOP4]
OP?#7  VOS618A  [VOS618A-SSOP4]
OP?#8  VOS618A  [VOS618A-SSOP4]
R21  10K  [R 0603]
R24  10K  [R 0603]
R25  1K  [R 0603]
R27  1K  [R 0603]
R41  10K  [R 0603]
R42  10K  [R 0603]
R43  1K  [R 0603]
R45  1K  [R 0603]
R53  10K  [R 0603]
R54  10K  [R 0603]
R55  1K  [R 0603]
R57  1K  [R 0603]
R60  10K  [R 0603]
R61  10K  [R 0603]
R62  1K  [R 0603]
R64  1K  [R 0603]
R?#3  10K  [R 0805]
R?#4  10K  [R 0805]
R?#5  10K  [R 0603]
R?#6  10K  [R 0603]
R?#7  1K  [R 0603]
R?#8  1K  [R 0603]
R?#9  10K  [R 0603]
R?#10  10K  [R 0603]
R?#11  1K  [R 0603]
R?#12  1K  [R 0603]
R?#13  10K  [R 0603]
R?#14  10K  [R 0603]
R?#15  1K  [R 0603]
R?#16  1K  [R 0603]
R?#17  10K  [R 0603]
R?#18  10K  [R 0603]
R?#19  1K  [R 0603]
R?#20  1K  [R 0603]
RA1  10K  [RA1206 (4x0603)]
U5  MCP23017  [SOIC28]

### Ports
TO_INTA (out), TO_INTB (out), TO_RESET (in), TO_SCL (bidir), TO_SDA (bidir)

### Nets
3.3V: R?#3.2 R?#4.2 RA1.5 RA1.6 RA1.7 RA1.8 U5.9(VDD)
24V: D1.2(K) D2.2(K) D5.2(K) D6.2(K) D9.2(K) D10.2(K) D13.2(K) D14.2(K) D?#1.2(K) D?#2.2(K) D?#3.2(K) D?#4.2(K) D?#5.2(K) D?#6.2(K) D?#7.2(K) D?#8.2(K) R21.2 R24.2 R41.2 R42.2 R53.2 R54.2 R60.2 R61.2 R?#5.2 R?#6.2 R?#9.2 R?#10.2 R?#13.2 R?#14.2 R?#17.2 R?#18.2
GND: OP14.3(E) OP15.3(E) OP20.3(E) OP21.3(E) OP24.3(E) OP25.3(E) OP26.3(E) OP27.3(E) OP?#1.3(E) OP?#2.3(E) OP?#3.3(E) OP?#4.3(E) OP?#5.3(E) OP?#6.3(E) OP?#7.3(E) OP?#8.3(E)
GND_F: OP14.2(K) OP15.2(K) OP20.2(K) OP21.2(K) OP24.2(K) OP25.2(K) OP26.2(K) OP27.2(K) OP?#1.2(K) OP?#2.2(K) OP?#3.2(K) OP?#4.2(K) OP?#5.2(K) OP?#6.2(K) OP?#7.2(K) OP?#8.2(K) U5.10(VSS)
DIGITAL_SCL: R?#4.1 U5.12(SCL) ; port TO_SCL
DIGITAL_SDA: R?#3.1 U5.13(SDA) ; port TO_SDA
DOUT0: R25.1 U5.21(GPA0)
DOUT1: R27.1 U5.22(GPA1)
DOUT2: R43.1 U5.23(GPA2)
DOUT3: R45.1 U5.24(GPA3)
DOUT4: R55.1 U5.25(GPA4)
DOUT5: R57.1 U5.26(GPA5)
DOUT6: R62.1 U5.27(GPA6)
DOUT7: R64.1 U5.28(GPA7)
DOUT8: R?#7.1 U5.1(GPB0)
DOUT9: R?#8.1 U5.2(GPB1)
DOUT10: R?#11.1 U5.3(GPB2)
DOUT11: R?#12.1 U5.4(GPB3)
DOUT12: R?#15.1 U5.5(GPB4)
DOUT13: R?#16.1 U5.6(GPB5)
DOUT14: R?#19.1 U5.7(GPB6)
DOUT15: R?#20.1 U5.8(GPB7)
DOUT_PORT_0: D1.1(A) JP5.1 LED9.2(K) OP14.4(C)
DOUT_PORT_1: D2.1(A) JP5.2 LED10.2(K) OP15.4(C)
DOUT_PORT_2: D5.1(A) JP5.3 LED15.2(K) OP20.4(C)
DOUT_PORT_3: D6.1(A) JP5.4 LED16.2(K) OP21.4(C)
DOUT_PORT_4: D9.1(A) JP5.5 LED19.2(K) OP24.4(C)
DOUT_PORT_5: D10.1(A) JP5.6 LED20.2(K) OP25.4(C)
DOUT_PORT_6: D13.1(A) JP5.7 LED21.2(K) OP26.4(C)
DOUT_PORT_7: D14.1(A) JP5.8 LED22.2(K) OP27.4(C)
DOUT_PORT_8: D?#1.1(A) JP?#1.1 LED?#1.2(K) OP?#1.4(C)
DOUT_PORT_9: D?#2.1(A) JP?#1.2 LED?#2.2(K) OP?#2.4(C)
DOUT_PORT_10: D?#3.1(A) JP?#1.3 LED?#3.2(K) OP?#3.4(C)
DOUT_PORT_11: D?#4.1(A) JP?#1.4 LED?#4.2(K) OP?#4.4(C)
DOUT_PORT_12: D?#5.1(A) JP?#1.5 LED?#5.2(K) OP?#5.4(C)
DOUT_PORT_13: D?#6.1(A) JP?#1.6 LED?#6.2(K) OP?#6.4(C)
DOUT_PORT_14: D?#7.1(A) JP?#1.7 LED?#7.2(K) OP?#7.4(C)
DOUT_PORT_15: D?#8.1(A) JP?#1.8 LED?#8.2(K) OP?#8.4(C)
TO_INTA: U5.20(INTA) ; port TO_INTA
TO_INTB: U5.19(INTB) ; port TO_INTB
TO_RESET: RA1.1 U5.18(RESET) ; port TO_RESET
NetLED9_1: LED9.1(A) R21.1
NetLED10_1: LED10.1(A) R24.1
NetLED15_1: LED15.1(A) R41.1
NetLED16_1: LED16.1(A) R42.1
NetLED19_1: LED19.1(A) R53.1
NetLED20_1: LED20.1(A) R54.1
NetLED21_1: LED21.1(A) R60.1
NetLED22_1: LED22.1(A) R61.1
NetLED?#1_1: LED?#1.1(A) R?#5.1
NetLED?#2_1: LED?#2.1(A) R?#6.1
NetLED?#3_1: LED?#3.1(A) R?#9.1
NetLED?#4_1: LED?#4.1(A) R?#10.1
NetLED?#5_1: LED?#5.1(A) R?#13.1
NetLED?#6_1: LED?#6.1(A) R?#14.1
NetLED?#7_1: LED?#7.1(A) R?#17.1
NetLED?#8_1: LED?#8.1(A) R?#18.1
NetOP14_1: OP14.1(A) R25.2
NetOP15_1: OP15.1(A) R27.2
NetOP20_1: OP20.1(A) R43.2
NetOP21_1: OP21.1(A) R45.2
NetOP24_1: OP24.1(A) R55.2
NetOP25_1: OP25.1(A) R57.2
NetOP26_1: OP26.1(A) R62.2
NetOP27_1: OP27.1(A) R64.2
NetOP?#1_1: OP?#1.1(A) R?#7.2
NetOP?#2_1: OP?#2.1(A) R?#8.2
NetOP?#3_1: OP?#3.1(A) R?#11.2
NetOP?#4_1: OP?#4.1(A) R?#12.2
NetOP?#5_1: OP?#5.1(A) R?#15.2
NetOP?#6_1: OP?#6.1(A) R?#16.2
NetOP?#7_1: OP?#7.1(A) R?#19.2
NetOP?#8_1: OP?#8.1(A) R?#20.2
NetRA1_2: RA1.2 U5.17(A2)
NetRA1_3: RA1.3 U5.16(A1)
NetRA1_4: RA1.4 U5.15(A0)

Not connected (* = marked no-connect by the designer): U5 11(NC)* 14(NC)*

### Library data of the parts
D1 D2 D5 D6 D9 D10 D13 D14 D?#1-D?#8 = 1N4148: High speed switching diode; BOM名称: 高速开关二极管; 版权归属: 源创客; 学习资源: www.ooocke.com
JP5 JP?#1 = Header 8: 8P Connector; BOM名称: 8P接插件; 版权归属: 源创客; 学习资源: www.ooocke.com
LED9 LED10 LED15 LED16 LED19-LED22 LED?#1-LED?#8 = LED-SMD: Patch LED; BOM名称: 贴片LED; 版权归属: 源创客; 学习资源: www.ooocke.com
R21 R24 R25 R27 R41-R43 R45 R53-R55 R57 R60-R62 R64 R?#3-R?#20 = R: Chip resistor; 版权归属: 源创客; BOM名称: Chip resistor; 学习资源: www.ooocke.com
RA1 = R-ARR: 4 way Chip Resistor Array

## Sheet GPIO.SchDoc
size 457 x 457 mm; SheetNumber: 8; SheetTotal: 12
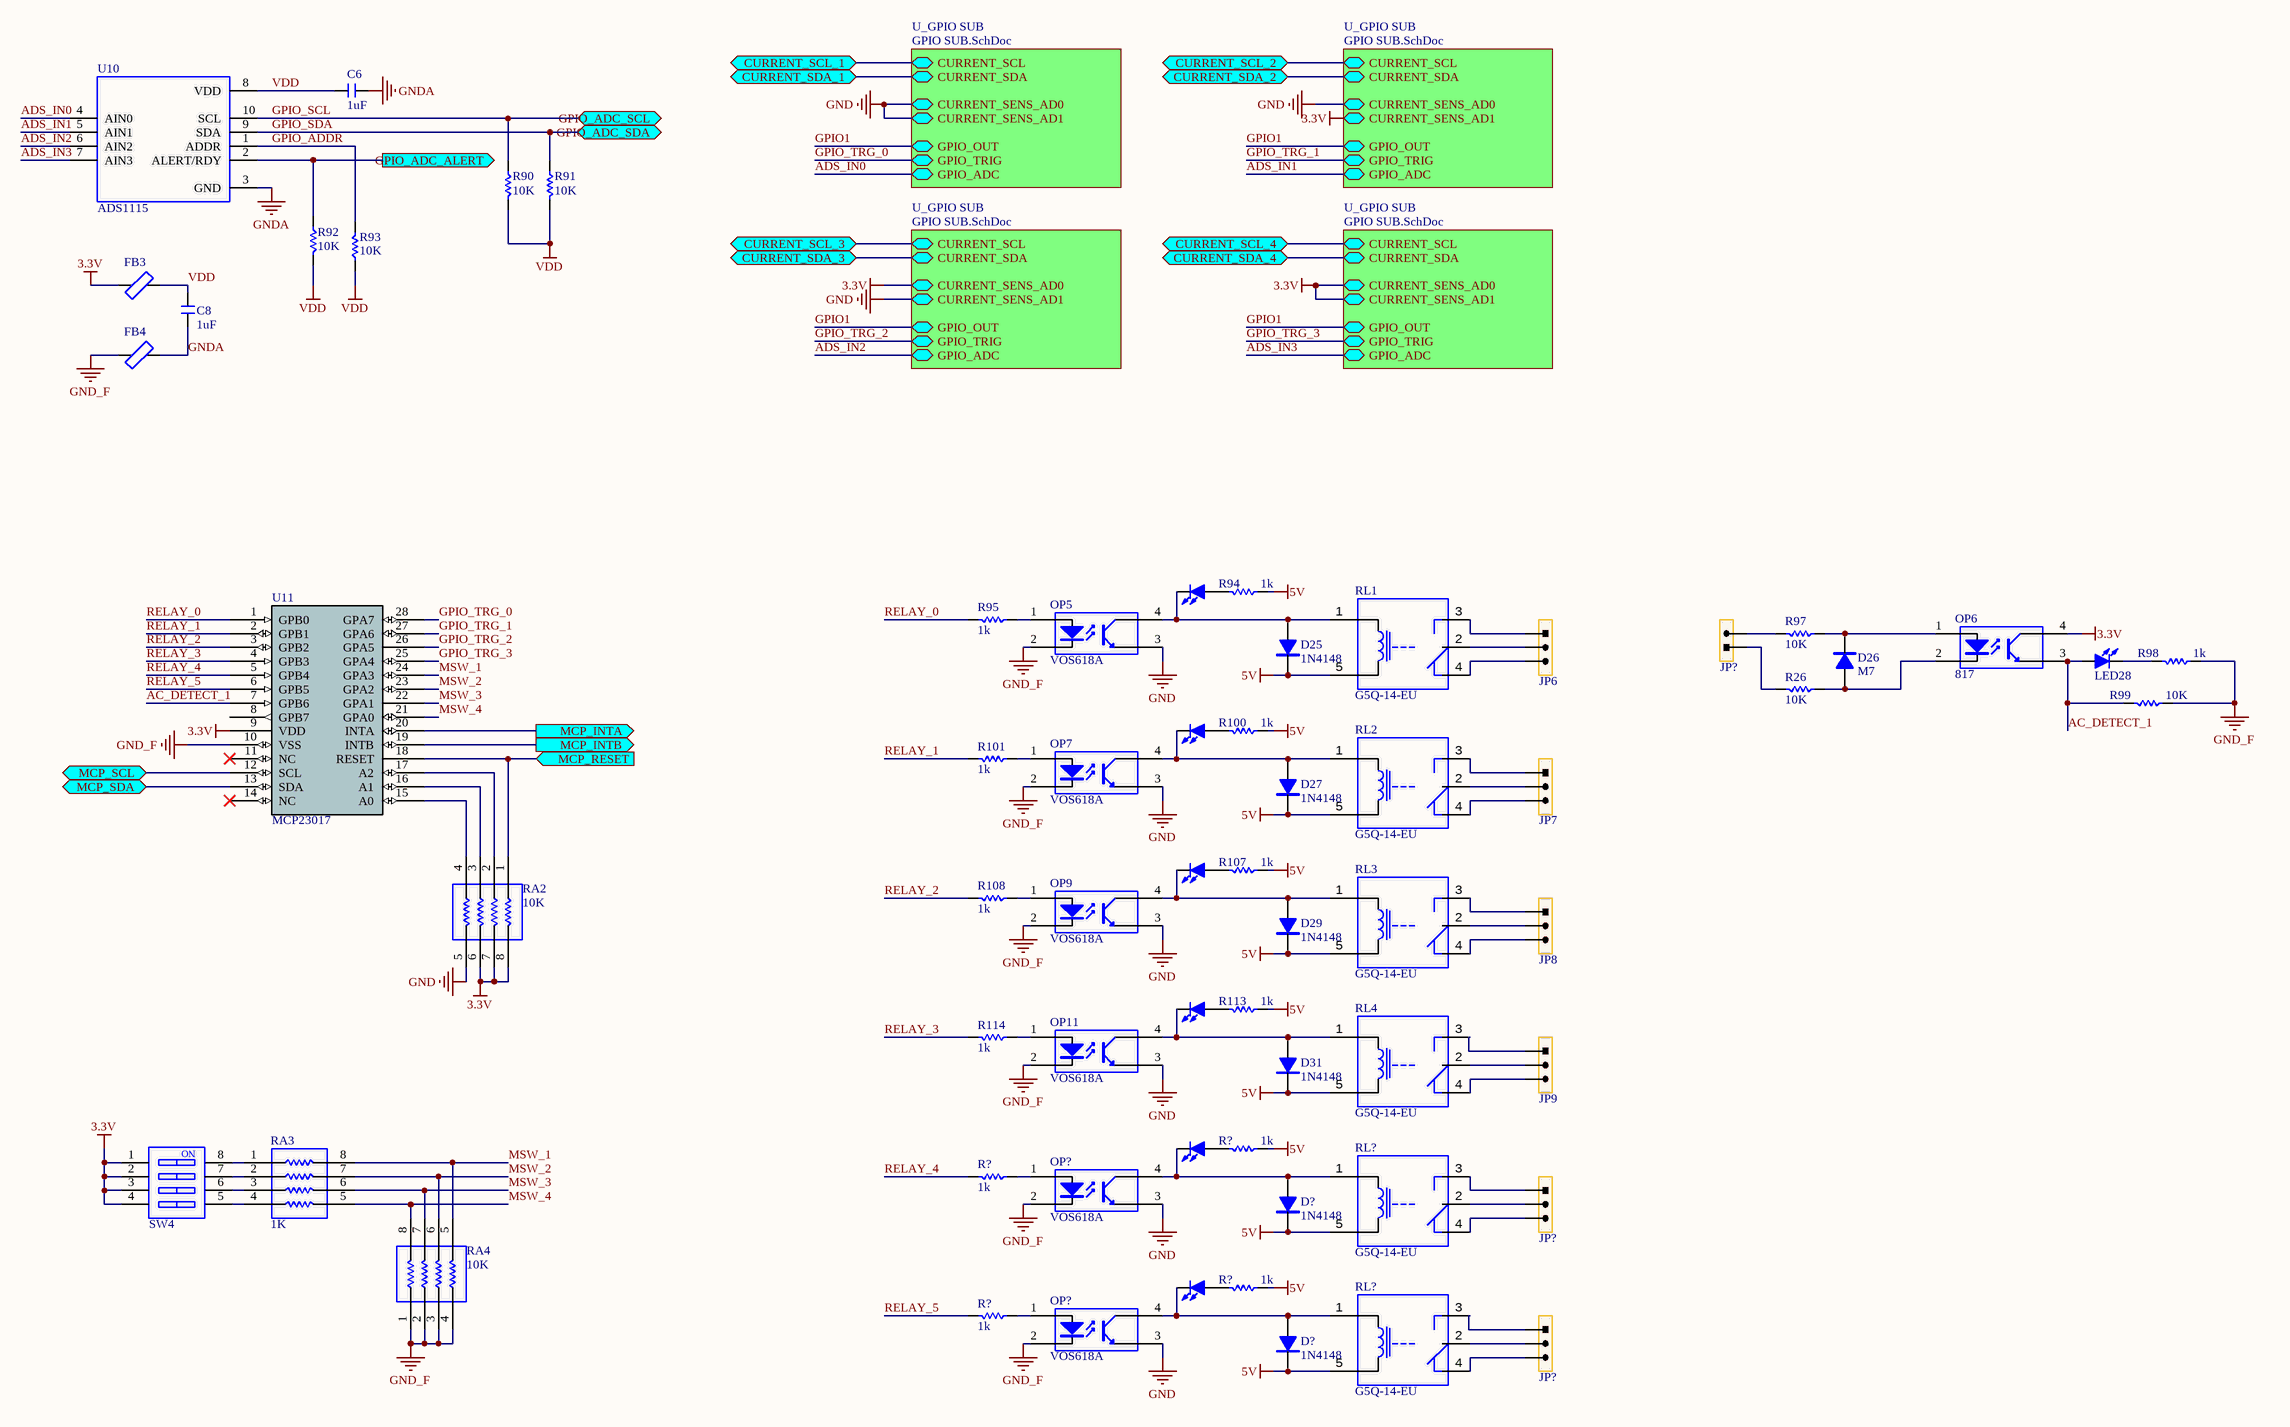
[diagram p7: GPIO.SchDoc]

### Parts
(Parts that share a designator on the sheet are numbered #1, #2 ... from top to bottom, then left to right.)
C6  1uF  [C 0805]
C8  1uF  [C 0805]
D25  1N4148  [SOD-323]
D26  M7  [SMA]
D27  1N4148  [SOD-323]
D29  1N4148  [SOD-323]
D31  1N4148  [SOD-323]
D?#9  1N4148  [SOD-323]
D?#10  1N4148  [SOD-323]
FB3  (no value)  [F 0805]
FB4  (no value)  [F 0805]
JP6  HDR-1X3  [KF-3P-BLK-H-3.81]  (value not drawn)
JP7  HDR-1X3  [KF-3P-BLK-H-3.81]  (value not drawn)
JP8  HDR-1X3  [KF-3P-BLK-H-3.81]  (value not drawn)
JP9  HDR-1X3  [KF-3P-BLK-H-3.81]  (value not drawn)
JP?#2  HDR-1X2  [KF381GR-2]  (value not drawn)
JP?#3  HDR-1X3  [KF-3P-BLK-H-3.81]  (value not drawn)
JP?#4  HDR-1X3  [KF-3P-BLK-H-3.81]  (value not drawn)
LED27  LED-SMD  [LED 0805B]  (value not drawn)
LED28  LED-SMD  [LED 0805B]  (value not drawn)
LED29  LED-SMD  [LED 0805B]  (value not drawn)
LED31  LED-SMD  [LED 0805B]  (value not drawn)
LED33  LED-SMD  [LED 0805B]  (value not drawn)
LED?#9  LED-SMD  [LED 0805B]  (value not drawn)
LED?#10  LED-SMD  [LED 0805B]  (value not drawn)
OP5  VOS618A  [VOS618A-SSOP4]
OP6  817  [PC817-SMD]
OP7  VOS618A  [VOS618A-SSOP4]
OP9  VOS618A  [VOS618A-SSOP4]
OP11  VOS618A  [VOS618A-SSOP4]
OP?#9  VOS618A  [VOS618A-SSOP4]
OP?#10  VOS618A  [VOS618A-SSOP4]
R26  10K  [R 0805]
R90  10K  [R 0805]
R91  10K  [R 0805]
R92  10K  [R 0805]
R93  10K  [R 0805]
R94  1k  [R 0805]
R95  1k  [R 0805]
R97  10K  [R 0805]
R98  1k  [R 0805]
R99  10K  [R 0805]
R100  1k  [R 0805]
R101  1k  [R 0805]
R107  1k  [R 0805]
R108  1k  [R 0805]
R113  1k  [R 0805]
R114  1k  [R 0805]
R?#21  1k  [R 0805]
R?#22  1k  [R 0805]
R?#23  1k  [R 0805]
R?#24  1k  [R 0805]
RA2  10K  [RA1206 (4x0603)]
RA3  1K  [RA1206 (4x0603)]
RA4  10K  [RA1206 (4x0603)]
RL1  G5Q-14-EU  [G5Q-14-EU]
RL2  G5Q-14-EU  [G5Q-14-EU]
RL3  G5Q-14-EU  [G5Q-14-EU]
RL4  G5Q-14-EU  [G5Q-14-EU]
RL?#1  G5Q-14-EU  [G5Q-14-EU]
RL?#2  G5Q-14-EU  [G5Q-14-EU]
SW4  CSW-4P  [CSW DIP-4P_G]  (value not drawn)
U10  ADS1115  [VSSOP10-N]
U11  MCP23017  [SOIC28]

### Sub-sheets
U_GPIO SUB = GPIO SUB.SchDoc: CURRENT_SCL (bidir), CURRENT_SDA (bidir), CURRENT_SENS_AD0 (bidir), CURRENT_SENS_AD1 (bidir), GPIO_OUT (bidir), GPIO_TRIG (bidir), GPIO_ADC (bidir)
U_GPIO SUB = GPIO SUB.SchDoc: CURRENT_SCL (bidir), CURRENT_SDA (bidir), CURRENT_SENS_AD0 (bidir), CURRENT_SENS_AD1 (bidir), GPIO_OUT (bidir), GPIO_TRIG (bidir), GPIO_ADC (bidir)
U_GPIO SUB = GPIO SUB.SchDoc: CURRENT_SCL (bidir), CURRENT_SDA (bidir), CURRENT_SENS_AD0 (bidir), CURRENT_SENS_AD1 (bidir), GPIO_OUT (bidir), GPIO_TRIG (bidir), GPIO_ADC (bidir)
U_GPIO SUB = GPIO SUB.SchDoc: CURRENT_SCL (bidir), CURRENT_SDA (bidir), CURRENT_SENS_AD0 (bidir), CURRENT_SENS_AD1 (bidir), GPIO_OUT (bidir), GPIO_TRIG (bidir), GPIO_ADC (bidir)

### Ports
CURRENT_SCL_1 (bidir), CURRENT_SCL_2 (bidir), CURRENT_SCL_3 (bidir), CURRENT_SCL_4 (bidir), CURRENT_SDA_1 (bidir), CURRENT_SDA_2 (bidir), CURRENT_SDA_3 (bidir), CURRENT_SDA_4 (bidir), GPIO_ADC_ALERT (out), GPIO_ADC_SCL (bidir), GPIO_ADC_SDA (bidir), MCP_INTA (out), MCP_INTB (out), MCP_RESET (in), MCP_SCL (bidir), MCP_SDA (bidir)

### Nets
3.3V: FB3.1 OP6.4(C) RA2.6 RA2.7 RA2.8 SW4.1 SW4.2 SW4.3 SW4.4 U11.9(VDD) ; sheet U_GPIO SUB/CURRENT_SENS_AD0, sheet U_GPIO SUB/CURRENT_SENS_AD1, sheet U_GPIO SUB/CURRENT_SENS_AD0, sheet U_GPIO SUB/CURRENT_SENS_AD1
5V: D25.2(K) D27.2(K) D29.2(K) D31.2(K) D?#9.2(K) D?#10.2(K) R94.1 R100.1 R107.1 R113.1 R?#21.1 R?#23.1 RL1.5(A2) RL2.5(A2) RL3.5(A2) RL4.5(A2) RL?#1.5(A2) RL?#2.5(A2)  [project net VOUT]
GND: OP5.3(E) OP7.3(E) OP9.3(E) OP11.3(E) OP?#9.3(E) OP?#10.3(E) RA2.5 ; sheet U_GPIO SUB/CURRENT_SENS_AD0, sheet U_GPIO SUB/CURRENT_SENS_AD1, sheet U_GPIO SUB/CURRENT_SENS_AD1, sheet U_GPIO SUB/CURRENT_SENS_AD0
GND_F: FB4.1 OP5.2(K) OP7.2(K) OP9.2(K) OP11.2(K) OP?#9.2(K) OP?#10.2(K) R98.1 R99.1 RA4.1 RA4.2 RA4.3 RA4.4 U11.10(VSS)
GNDA: C6.1 C8.1 FB4.2 U10.3(GND)
VDD: C6.2 C8.2 FB3.2 R90.2 R91.2 R92.2 R93.1 U10.8(VDD)
AC_DETECT_1: LED28.1(A) OP6.3(E) R99.2 U11.7(GPB6)
ADS_IN0: U10.4(AIN0) ; sheet U_GPIO SUB/GPIO_ADC
ADS_IN1: U10.5(AIN1) ; sheet U_GPIO SUB/GPIO_ADC
ADS_IN2: U10.6(AIN2) ; sheet U_GPIO SUB/GPIO_ADC
ADS_IN3: U10.7(AIN3) ; sheet U_GPIO SUB/GPIO_ADC
GPIO1: sheet U_GPIO SUB/GPIO_OUT, sheet U_GPIO SUB/GPIO_OUT, sheet U_GPIO SUB/GPIO_OUT, sheet U_GPIO SUB/GPIO_OUT
GPIO_ADC_ALERT: R92.1 U10.2(ALERT/RDY) ; port GPIO_ADC_ALERT
GPIO_ADDR: R93.2 U10.1(ADDR)
GPIO_SCL: R90.1 U10.10(SCL) U11.12(SCL) ; port MCP_SCL, port GPIO_ADC_SCL, port CURRENT_SCL_1, port CURRENT_SCL_3, port CURRENT_SCL_2, port CURRENT_SCL_4, sheet U_GPIO SUB/CURRENT_SCL, sheet U_GPIO SUB/CURRENT_SCL, sheet U_GPIO SUB/CURRENT_SCL, sheet U_GPIO SUB/CURRENT_SCL  [project net DIGITAL_SCL]
GPIO_SDA: R91.1 U10.9(SDA) U11.13(SDA) ; port MCP_SDA, port GPIO_ADC_SDA, port CURRENT_SDA_1, port CURRENT_SDA_3, port CURRENT_SDA_2, port CURRENT_SDA_4, sheet U_GPIO SUB/CURRENT_SDA, sheet U_GPIO SUB/CURRENT_SDA, sheet U_GPIO SUB/CURRENT_SDA, sheet U_GPIO SUB/CURRENT_SDA  [project net DIGITAL_SDA]
GPIO_TRG_0: U11.28(GPA7) ; sheet U_GPIO SUB/GPIO_TRIG
GPIO_TRG_1: U11.27(GPA6) ; sheet U_GPIO SUB/GPIO_TRIG
GPIO_TRG_2: U11.26(GPA5) ; sheet U_GPIO SUB/GPIO_TRIG
GPIO_TRG_3: U11.25(GPA4) ; sheet U_GPIO SUB/GPIO_TRIG
MCP_INTA: U11.20(INTA) ; port MCP_INTA
MCP_INTB: U11.19(INTB) ; port MCP_INTB
MCP_RESET: RA2.1 U11.18(RESET) ; port MCP_RESET
MSW_1: RA3.8 RA4.5 U11.24(GPA3)
MSW_2: RA3.7 RA4.6 U11.23(GPA2)
MSW_3: RA3.6 RA4.7 U11.22(GPA1)
MSW_4: RA3.5 RA4.8 U11.21(GPA0)
RELAY_0: R95.2 U11.1(GPB0)
RELAY_1: R101.2 U11.2(GPB1)
RELAY_2: R108.2 U11.3(GPB2)
RELAY_3: R114.2 U11.4(GPB3)
RELAY_4: R?#22.2 U11.5(GPB4)
RELAY_5: R?#24.2 U11.6(GPB5)
NetD25_1: D25.1(A) LED27.2(K) OP5.4(C) RL1.1(A1)
NetD26_1: D26.1(A) OP6.2(K) R26.1
NetD26_2: D26.2(K) OP6.1(A) R97.1
NetD27_1: D27.1(A) LED29.2(K) OP7.4(C) RL2.1(A1)
NetD29_1: D29.1(A) LED31.2(K) OP9.4(C) RL3.1(A1)
NetD31_1: D31.1(A) LED33.2(K) OP11.4(C) RL4.1(A1)
NetD?#9_1: D?#9.1(A) LED?#9.2(K) OP?#9.4(C) RL?#1.1(A1)
NetD?#10_1: D?#10.1(A) LED?#10.2(K) OP?#10.4(C) RL?#2.1(A1)
NetJP6_1: JP6.1 RL1.3
NetJP6_2: JP6.2 RL1.2
NetJP6_3: JP6.3 RL1.4
NetJP7_1: JP7.1 RL2.3
NetJP7_2: JP7.2 RL2.2
NetJP7_3: JP7.3 RL2.4
NetJP8_1: JP8.1 RL3.3
NetJP8_2: JP8.2 RL3.2
NetJP8_3: JP8.3 RL3.4
NetJP9_1: JP9.1 RL4.3
NetJP9_2: JP9.2 RL4.2
NetJP9_3: JP9.3 RL4.4
NetJP?#2_1: JP?#2.1 R26.2
NetJP?#2_2: JP?#2.2 R97.2
NetJP?#3_1: JP?#3.1 RL?#1.3
NetJP?#3_2: JP?#3.2 RL?#1.2
NetJP?#3_3: JP?#3.3 RL?#1.4
NetJP?#4_1: JP?#4.1 RL?#2.3
NetJP?#4_2: JP?#4.2 RL?#2.2
NetJP?#4_3: JP?#4.3 RL?#2.4
NetLED27_1: LED27.1(A) R94.2
NetLED28_2: LED28.2(K) R98.2
NetLED29_1: LED29.1(A) R100.2
NetLED31_1: LED31.1(A) R107.2
NetLED33_1: LED33.1(A) R113.2
NetLED?#9_1: LED?#9.1(A) R?#21.2
NetLED?#10_1: LED?#10.1(A) R?#23.2
NetOP5_1: OP5.1(A) R95.1
NetOP7_1: OP7.1(A) R101.1
NetOP9_1: OP9.1(A) R108.1
NetOP11_1: OP11.1(A) R114.1
NetOP?#9_1: OP?#9.1(A) R?#22.1
NetOP?#10_1: OP?#10.1(A) R?#24.1
NetRA2_2: RA2.2 U11.17(A2)
NetRA2_3: RA2.3 U11.16(A1)
NetRA2_4: RA2.4 U11.15(A0)
NetRA3_1: RA3.1 SW4.8
NetRA3_2: RA3.2 SW4.7
NetRA3_3: RA3.3 SW4.6
NetRA3_4: RA3.4 SW4.5

Not connected (* = marked no-connect by the designer): U11 8(GPB7) 11(NC)* 14(NC)*

### Notes on the sheet
- (in symbol CSW-4P) NO

### Library data of the parts
C6 C8 = C: as C1 on sheet Main; 学习资源: www.ooocke.com
D25 D27 D29 D31 D?#9 D?#10 = 1N4148: as D1 on sheet Transistor Output; 学习资源: www.ooocke.com
D26 = M7: Rectifier diode; BOM名称: 整流二极管; 版权归属: 源创客; 学习资源: www.ooocke.com
FB3 FB4 = FB: Ferrite Bead; BOM名称: 贴片电阻; 版权归属: 源创客; 学习资源: www.ooocke.com
JP6-JP9 JP?#3 JP?#4 = Header 3: 3P Connector; BOM名称: 3P接插件; 版权归属: 源创客; 学习资源: www.ooocke.com
JP?#2 = Header 2: 2P Connector; BOM名称: 2P接插件; 版权归属: 源创客; 学习资源: www.ooocke.com
LED27-LED29 LED31 LED33 LED?#9 LED?#10 = LED-SMD: Patch LED; BOM名称: 贴片LED; 版权归属: 源创客; 学习资源: www.ooocke.com
OP6 = 817: AC Input Photocoupler; BOM名称: 线性光耦; 版权归属: 源创客; 学习资源: www.ooocke.com
R26 R90-R95 R97-R101 R107 R108 R113 R114 R?#21-R?#24 = R: Chip resistor; 版权归属: 源创客; BOM名称: Chip resistor; 学习资源: www.ooocke.com
RA2-RA4 = R-ARR: 4 way Chip Resistor Array
SW4 = CSW-4P: 4-way code switch; BOM名称: 4路编码开关; 版权归属: 源创客; 学习资源: www.ooocke.com
U10 = ADS1115: as U17 on sheet Analog Input; 学习资源: www.ooocke.com

## Sheet GPIO SUB.SchDoc
size A4; SheetNumber: 9; SheetTotal: 12
Used 4 times, as channels U_GPIO/U_GPIO SUB, U_GPIO/U_GPIO SUB, U_GPIO/U_GPIO SUB, U_GPIO/U_GPIO SUB. Parts and nets are listed once, with the designators drawn on the sheet.
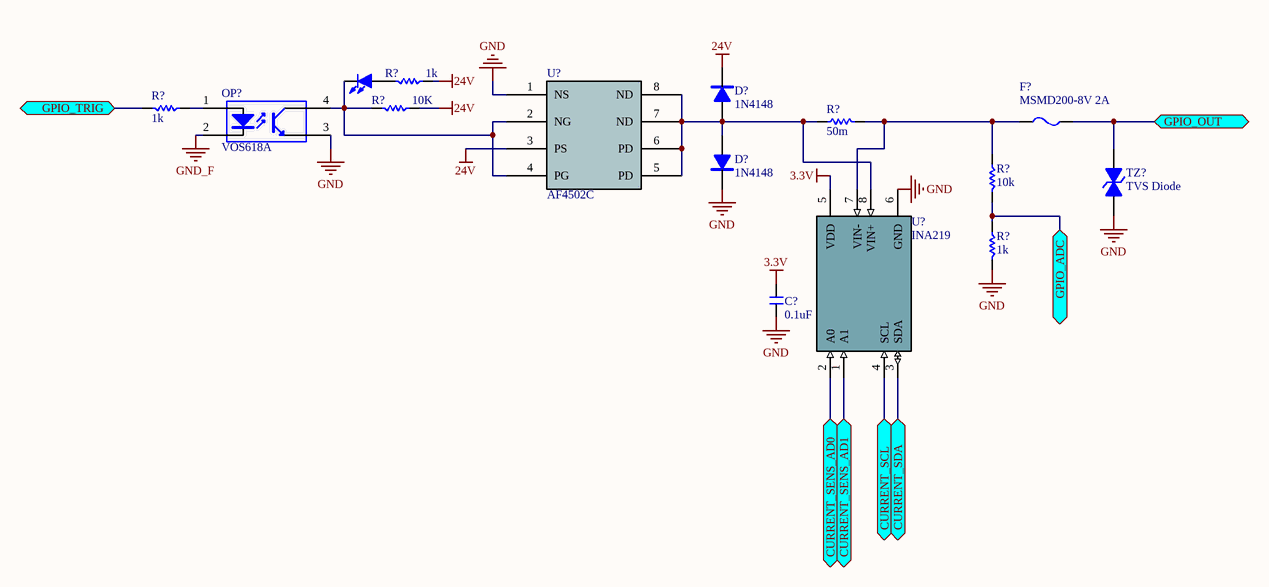
[diagram p8: GPIO SUB.SchDoc]

### Parts
(Parts that share a designator on the sheet are numbered #1, #2 ... from top to bottom, then left to right.)
C?  0.1uF  [C 0805]
D?#1  1N4148  [SOD-323]
D?#2  1N4148  [SOD-323]
F?  MSMD200-8V 2A  [FU 0805]
LED?  LED-SMD  [LED 0805B]  (value not drawn)
OP?  VOS618A  [VOS618A-SSOP4]
R?#1  1k  [R 0805]
R?#2  1k  [R 0805]
R?#3  10K  [R 0805]
R?#4  50m  [R 1812]
R?#5  10k  [R 0805]
R?#6  1k  [R 0805]
TZ?  TVS Diode  [SMB]
U?#1  AF4502C  [SOP8_L]
U?#2  INA219  [SOT23-8]

### Ports
CURRENT_SCL (bidir), CURRENT_SDA (bidir), CURRENT_SENS_AD0 (bidir), CURRENT_SENS_AD1 (bidir), GPIO_ADC (bidir), GPIO_OUT (bidir), GPIO_TRIG (bidir)

### Nets
3.3V: C?.2 U?#2.5(VDD)
24V: D?#1.2(K) R?#1.1 R?#3.1 U?#1.3(PS)
GND: C?.1 D?#2.2(K) OP?.3(E) R?#6.2 TZ?.1(A) U?#1.1(NS) U?#2.6(GND)
GND_F: OP?.2(K)
CURRENT_SCL: U?#2.4(SCL) ; port CURRENT_SCL
CURRENT_SDA: U?#2.3(SDA) ; port CURRENT_SDA
CURRENT_SENS_AD0: U?#2.2(A0) ; port CURRENT_SENS_AD0
CURRENT_SENS_AD1: U?#2.1(A1) ; port CURRENT_SENS_AD1
GPIO_ADC: R?#5.2 R?#6.1 ; port GPIO_ADC
GPIO_OUT: F?.2 TZ?.2(K) ; port GPIO_OUT
GPIO_TRIG: R?#2.2 ; port GPIO_TRIG
NetD?#1_1: D?#1.1(A) D?#2.1(A) R?#4.1 U?#1.5(PD) U?#1.6(PD) U?#1.7(ND) U?#1.8(ND) U?#2.8(VIN+)
NetF?_1: F?.1 R?#4.2 R?#5.1 U?#2.7(VIN-)
NetLED?_1: LED?.1(A) R?#1.2
NetLED?_2: LED?.2(K) OP?.4(C) R?#3.2 U?#1.2(NG) U?#1.4(PG)
NetOP?_1: OP?.1(A) R?#2.1

### Channels
U_GPIO/U_GPIO SUB: designators C?=C?_U_GPIO_U_GPIO_SUB#1 D?=D?_U_GPIO_U_GPIO_SUB#1 D?=D?_U_GPIO_U_GPIO_SUB#2 F?=F?_U_GPIO_U_GPIO_SUB#1 LED?=LED?_U_GPIO_U_GPIO_SUB#1 OP?=OP?_U_GPIO_U_GPIO_SUB#1 R?=R?_U_GPIO_U_GPIO_SUB#2 R?=R?_U_GPIO_U_GPIO_SUB#3 R?=R?_U_GPIO_U_GPIO_SUB#1 R?=R?_U_GPIO_U_GPIO_SUB#4 R?=R?_U_GPIO_U_GPIO_SUB#5 R?=R?_U_GPIO_U_GPIO_SUB#6 TZ?=TZ?_U_GPIO_U_GPIO_SUB#1 U?=U?_U_GPIO_U_GPIO_SUB#2 U?=U?_U_GPIO_U_GPIO_SUB#1; ports CURRENT_SCL=DIGITAL_SCL CURRENT_SDA=DIGITAL_SDA CURRENT_SENS_AD0=GND CURRENT_SENS_AD1=GND GPIO_ADC=ADS_IN0 GPIO_OUT=GPIO1 GPIO_TRIG=GPIO_TRG_0
U_GPIO/U_GPIO SUB: designators C?=C?_U_GPIO_U_GPIO_SUB#2 D?=D?_U_GPIO_U_GPIO_SUB#3 D?=D?_U_GPIO_U_GPIO_SUB#4 F?=F?_U_GPIO_U_GPIO_SUB#2 LED?=LED?_U_GPIO_U_GPIO_SUB#2 OP?=OP?_U_GPIO_U_GPIO_SUB#2 R?=R?_U_GPIO_U_GPIO_SUB#8 R?=R?_U_GPIO_U_GPIO_SUB#9 R?=R?_U_GPIO_U_GPIO_SUB#7 R?=R?_U_GPIO_U_GPIO_SUB#10 R?=R?_U_GPIO_U_GPIO_SUB#11 R?=R?_U_GPIO_U_GPIO_SUB#12 TZ?=TZ?_U_GPIO_U_GPIO_SUB#2 U?=U?_U_GPIO_U_GPIO_SUB#4 U?=U?_U_GPIO_U_GPIO_SUB#3; ports CURRENT_SCL=DIGITAL_SCL CURRENT_SDA=DIGITAL_SDA CURRENT_SENS_AD0=3.3V CURRENT_SENS_AD1=GND GPIO_ADC=ADS_IN2 GPIO_OUT=GPIO1 GPIO_TRIG=GPIO_TRG_2
U_GPIO/U_GPIO SUB: designators C?=C?_U_GPIO_U_GPIO_SUB#3 D?=D?_U_GPIO_U_GPIO_SUB#5 D?=D?_U_GPIO_U_GPIO_SUB#6 F?=F?_U_GPIO_U_GPIO_SUB#3 LED?=LED?_U_GPIO_U_GPIO_SUB#3 OP?=OP?_U_GPIO_U_GPIO_SUB#3 R?=R?_U_GPIO_U_GPIO_SUB#14 R?=R?_U_GPIO_U_GPIO_SUB#15 R?=R?_U_GPIO_U_GPIO_SUB#13 R?=R?_U_GPIO_U_GPIO_SUB#16 R?=R?_U_GPIO_U_GPIO_SUB#17 R?=R?_U_GPIO_U_GPIO_SUB#18 TZ?=TZ?_U_GPIO_U_GPIO_SUB#3 U?=U?_U_GPIO_U_GPIO_SUB#6 U?=U?_U_GPIO_U_GPIO_SUB#5; ports CURRENT_SCL=DIGITAL_SCL CURRENT_SDA=DIGITAL_SDA CURRENT_SENS_AD0=GND CURRENT_SENS_AD1=3.3V GPIO_ADC=ADS_IN1 GPIO_OUT=GPIO1 GPIO_TRIG=GPIO_TRG_1
U_GPIO/U_GPIO SUB: designators C?=C?_U_GPIO_U_GPIO_SUB#4 D?=D?_U_GPIO_U_GPIO_SUB#7 D?=D?_U_GPIO_U_GPIO_SUB#8 F?=F?_U_GPIO_U_GPIO_SUB#4 LED?=LED?_U_GPIO_U_GPIO_SUB#4 OP?=OP?_U_GPIO_U_GPIO_SUB#4 R?=R?_U_GPIO_U_GPIO_SUB#20 R?=R?_U_GPIO_U_GPIO_SUB#21 R?=R?_U_GPIO_U_GPIO_SUB#19 R?=R?_U_GPIO_U_GPIO_SUB#22 R?=R?_U_GPIO_U_GPIO_SUB#23 R?=R?_U_GPIO_U_GPIO_SUB#24 TZ?=TZ?_U_GPIO_U_GPIO_SUB#4 U?=U?_U_GPIO_U_GPIO_SUB#8 U?=U?_U_GPIO_U_GPIO_SUB#7; ports CURRENT_SCL=DIGITAL_SCL CURRENT_SDA=DIGITAL_SDA CURRENT_SENS_AD0=3.3V CURRENT_SENS_AD1=3.3V GPIO_ADC=ADS_IN3 GPIO_OUT=GPIO1 GPIO_TRIG=GPIO_TRG_3

### Library data of the parts
C? = C: as C1 on sheet Main; 学习资源: www.ooocke.com
D?#1 D?#2 = 1N4148: as D1 on sheet Transistor Output; 学习资源: www.ooocke.com
F? = FU: Chip fuse; BOM名称: 贴片保险丝; 版权归属: 源创客; 学习资源: www.ooocke.com
LED? = LED-SMD: Patch LED; BOM名称: 贴片LED; 版权归属: 源创客; 学习资源: www.ooocke.com
R?#1-R?#6 = R: Chip resistor; 版权归属: 源创客; BOM名称: Chip resistor; 学习资源: www.ooocke.com
TZ? = SMBJ-CA: as TZ5 on sheet Analog Input
U?#1 = AF4502C: PN-Mosfet

## Sheet Opto Input.SchDoc
size 381 x 241 mm; SheetNumber: 9; SheetTotal: 9
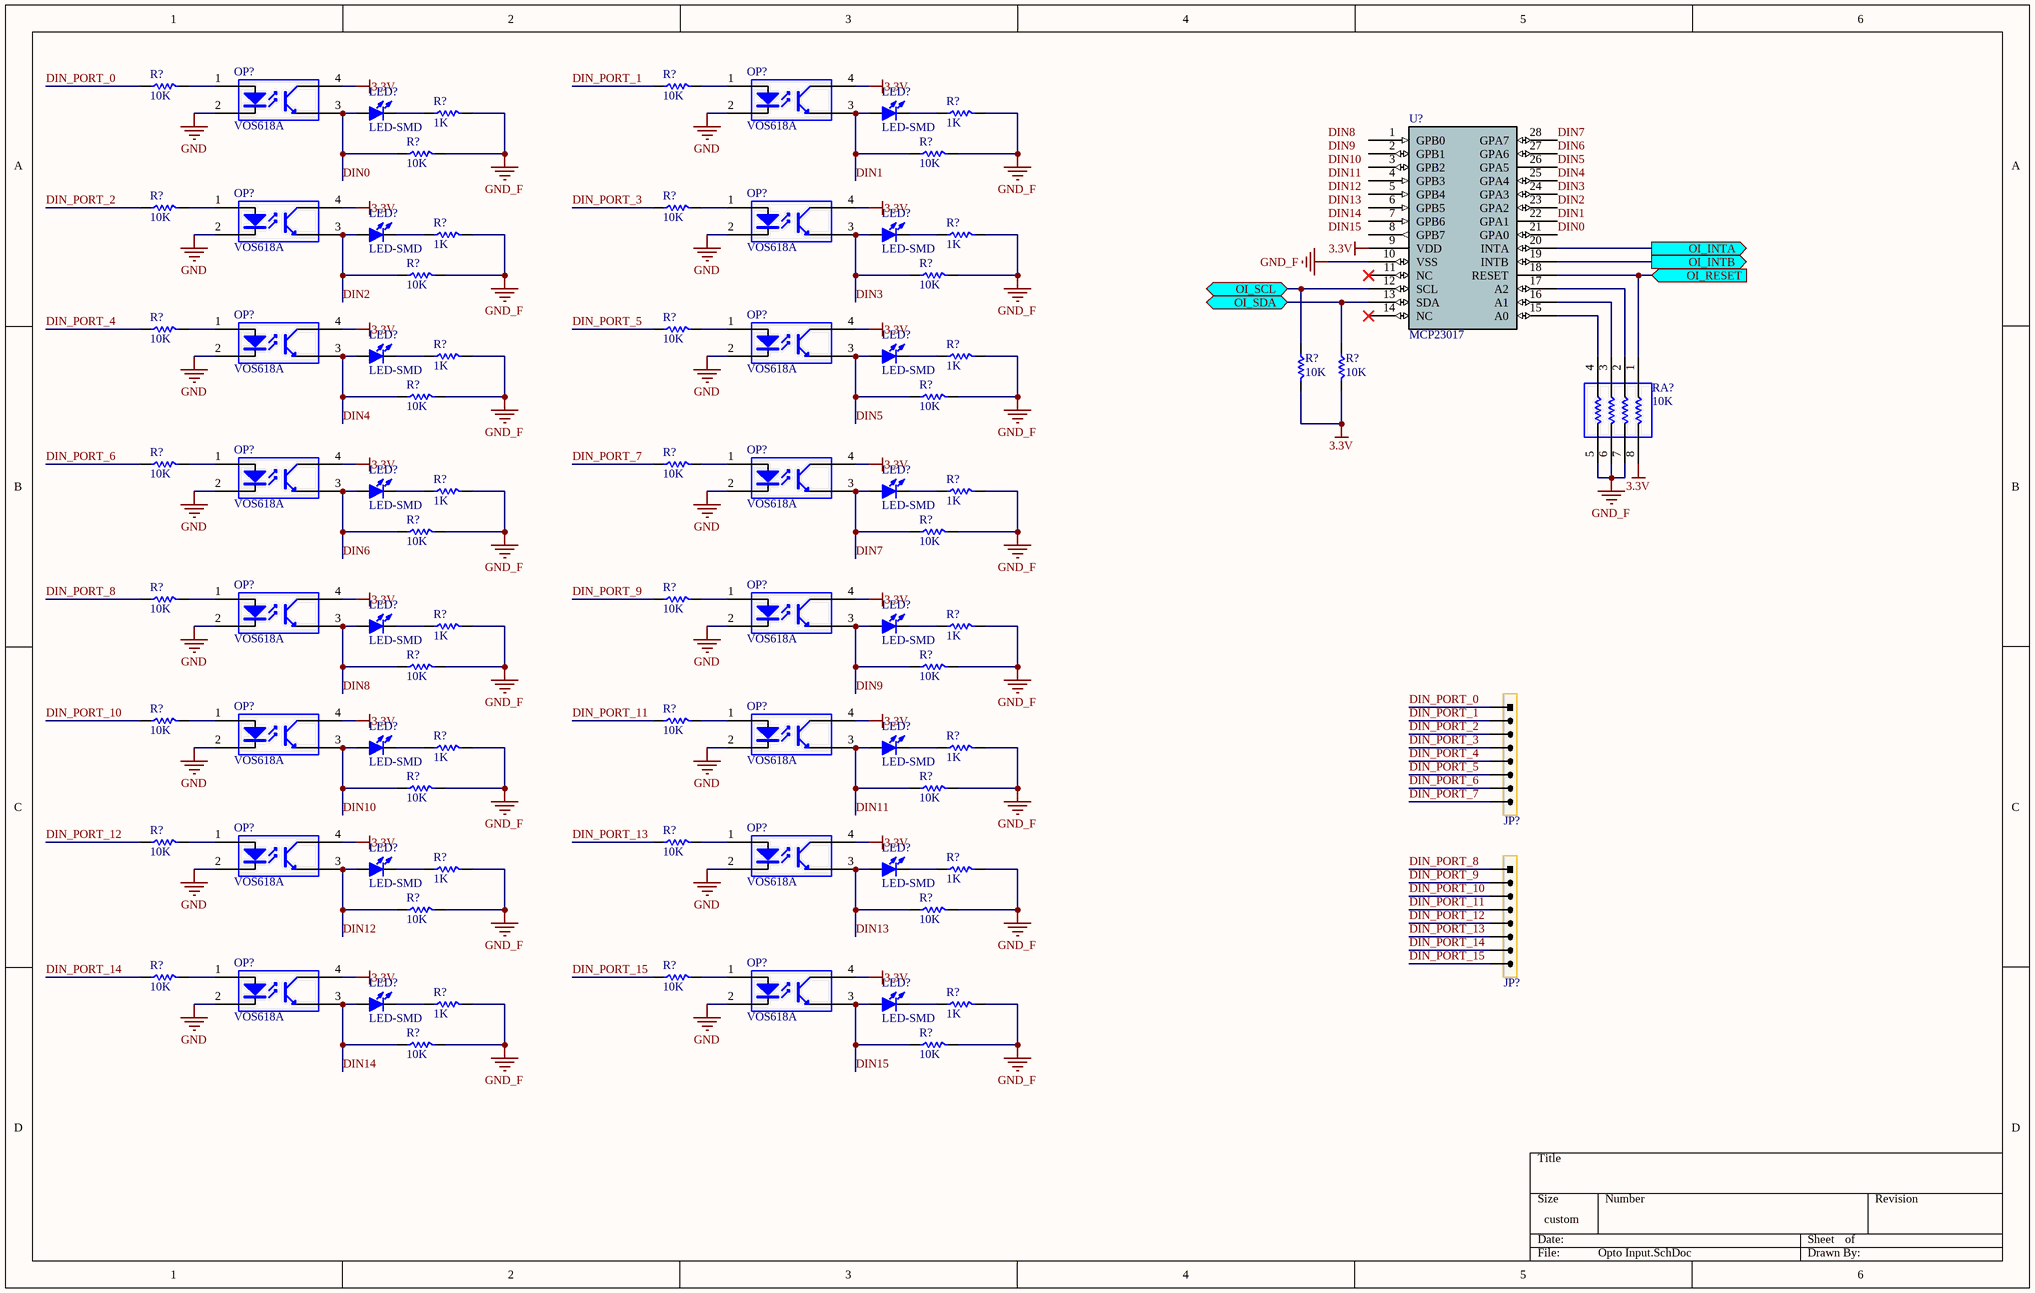
[diagram p9: Opto Input.SchDoc]

### Parts
(Parts that share a designator on the sheet are numbered #1, #2 ... from top to bottom, then left to right.)
JP?#5  HDR-1X8  [KF-8P-BLK-H-3.81]  (value not drawn)
JP?#6  HDR-1X8  [KF-8P-BLK-H-3.81]  (value not drawn)
LED?#11  LED-SMD  [LED 0603G]
LED?#12  LED-SMD  [LED 0603G]
LED?#13  LED-SMD  [LED 0603G]
LED?#14  LED-SMD  [LED 0603G]
LED?#15  LED-SMD  [LED 0603G]
LED?#16  LED-SMD  [LED 0603G]
LED?#17  LED-SMD  [LED 0603G]
LED?#18  LED-SMD  [LED 0603G]
LED?#19  LED-SMD  [LED 0603G]
LED?#20  LED-SMD  [LED 0603G]
LED?#21  LED-SMD  [LED 0603G]
LED?#22  LED-SMD  [LED 0603G]
LED?#23  LED-SMD  [LED 0603G]
LED?#24  LED-SMD  [LED 0603G]
LED?#25  LED-SMD  [LED 0603G]
LED?#26  LED-SMD  [LED 0603G]
OP?#11  VOS618A  [VOS618A-SSOP4]
OP?#12  VOS618A  [VOS618A-SSOP4]
OP?#13  VOS618A  [VOS618A-SSOP4]
OP?#14  VOS618A  [VOS618A-SSOP4]
OP?#15  VOS618A  [VOS618A-SSOP4]
OP?#16  VOS618A  [VOS618A-SSOP4]
OP?#17  VOS618A  [VOS618A-SSOP4]
OP?#18  VOS618A  [VOS618A-SSOP4]
OP?#19  VOS618A  [VOS618A-SSOP4]
OP?#20  VOS618A  [VOS618A-SSOP4]
OP?#21  VOS618A  [VOS618A-SSOP4]
OP?#22  VOS618A  [VOS618A-SSOP4]
OP?#23  VOS618A  [VOS618A-SSOP4]
OP?#24  VOS618A  [VOS618A-SSOP4]
OP?#25  VOS618A  [VOS618A-SSOP4]
OP?#26  VOS618A  [VOS618A-SSOP4]
R?#25  10K  [R 0603]
R?#26  10K  [R 0603]
R?#27  1K  [R 0603]
R?#28  1K  [R 0603]
R?#29  10K  [R 0603]
R?#30  10K  [R 0603]
R?#31  10K  [R 0603]
R?#32  10K  [R 0603]
R?#33  1K  [R 0603]
R?#34  1K  [R 0603]
R?#35  10K  [R 0603]
R?#36  10K  [R 0603]
R?#37  10K  [R 0603]
R?#38  10K  [R 0603]
R?#39  10K  [R 0805]
R?#40  10K  [R 0805]
R?#41  1K  [R 0603]
R?#42  1K  [R 0603]
R?#43  10K  [R 0603]
R?#44  10K  [R 0603]
R?#45  10K  [R 0603]
R?#46  10K  [R 0603]
R?#47  1K  [R 0603]
R?#48  1K  [R 0603]
R?#49  10K  [R 0603]
R?#50  10K  [R 0603]
R?#51  10K  [R 0603]
R?#52  10K  [R 0603]
R?#53  1K  [R 0603]
R?#54  1K  [R 0603]
R?#55  10K  [R 0603]
R?#56  10K  [R 0603]
R?#57  10K  [R 0603]
R?#58  10K  [R 0603]
R?#59  1K  [R 0603]
R?#60  1K  [R 0603]
R?#61  10K  [R 0603]
R?#62  10K  [R 0603]
R?#63  10K  [R 0603]
R?#64  10K  [R 0603]
R?#65  1K  [R 0603]
R?#66  1K  [R 0603]
R?#67  10K  [R 0603]
R?#68  10K  [R 0603]
R?#69  10K  [R 0603]
R?#70  10K  [R 0603]
R?#71  1K  [R 0603]
R?#72  1K  [R 0603]
R?#73  10K  [R 0603]
R?#74  10K  [R 0603]
RA?#2  10K  [RA1206 (4x0603)]
U?#2  MCP23017  [SOIC28]

### Ports
OI_INTA (out), OI_INTB (out), OI_RESET (in), OI_SCL (bidir), OI_SDA (bidir)

### Nets
3.3V: OP?#11.4(C) OP?#12.4(C) OP?#13.4(C) OP?#14.4(C) OP?#15.4(C) OP?#16.4(C) OP?#17.4(C) OP?#18.4(C) OP?#19.4(C) OP?#20.4(C) OP?#21.4(C) OP?#22.4(C) OP?#23.4(C) OP?#24.4(C) OP?#25.4(C) OP?#26.4(C) R?#39.2 R?#40.2 RA?#2.8 U?#2.9(VDD)
GND: OP?#11.2(K) OP?#12.2(K) OP?#13.2(K) OP?#14.2(K) OP?#15.2(K) OP?#16.2(K) OP?#17.2(K) OP?#18.2(K) OP?#19.2(K) OP?#20.2(K) OP?#21.2(K) OP?#22.2(K) OP?#23.2(K) OP?#24.2(K) OP?#25.2(K) OP?#26.2(K)
GND_F: R?#27.2 R?#28.2 R?#29.2 R?#30.2 R?#33.2 R?#34.2 R?#35.2 R?#36.2 R?#41.2 R?#42.2 R?#43.2 R?#44.2 R?#47.2 R?#48.2 R?#49.2 R?#50.2 R?#53.2 R?#54.2 R?#55.2 R?#56.2 R?#59.2 R?#60.2 R?#61.2 R?#62.2 R?#65.2 R?#66.2 R?#67.2 R?#68.2 R?#71.2 R?#72.2 R?#73.2 R?#74.2 RA?#2.5 RA?#2.6 RA?#2.7 U?#2.10(VSS)
DIGITAL_SCL: R?#39.1 U?#2.12(SCL) ; port OI_SCL
DIGITAL_SDA: R?#40.1 U?#2.13(SDA) ; port OI_SDA
DIN0: LED?#11.1(A) OP?#11.3(E) R?#29.1 U?#2.21(GPA0)
DIN1: LED?#12.1(A) OP?#12.3(E) R?#30.1 U?#2.22(GPA1)
DIN2: LED?#13.1(A) OP?#13.3(E) R?#35.1 U?#2.23(GPA2)
DIN3: LED?#14.1(A) OP?#14.3(E) R?#36.1 U?#2.24(GPA3)
DIN4: LED?#15.1(A) OP?#15.3(E) R?#43.1 U?#2.25(GPA4)
DIN5: LED?#16.1(A) OP?#16.3(E) R?#44.1 U?#2.26(GPA5)
DIN6: LED?#17.1(A) OP?#17.3(E) R?#49.1 U?#2.27(GPA6)
DIN7: LED?#18.1(A) OP?#18.3(E) R?#50.1 U?#2.28(GPA7)
DIN8: LED?#19.1(A) OP?#19.3(E) R?#55.1
DIN9: LED?#20.1(A) OP?#20.3(E) R?#56.1
DIN10: LED?#21.1(A) OP?#21.3(E) R?#61.1
DIN11: LED?#22.1(A) OP?#22.3(E) R?#62.1
DIN12: LED?#23.1(A) OP?#23.3(E) R?#67.1
DIN13: LED?#24.1(A) OP?#24.3(E) R?#68.1
DIN14: LED?#25.1(A) OP?#25.3(E) R?#73.1
DIN15: LED?#26.1(A) OP?#26.3(E) R?#74.1
DIN_PORT_0: JP?#5.1 R?#25.1
DIN_PORT_1: JP?#5.2 R?#26.1
DIN_PORT_2: JP?#5.3 R?#31.1
DIN_PORT_3: JP?#5.4 R?#32.1
DIN_PORT_4: JP?#5.5 R?#37.1
DIN_PORT_5: JP?#5.6 R?#38.1
DIN_PORT_6: JP?#5.7 R?#45.1
DIN_PORT_7: JP?#5.8 R?#46.1
DIN_PORT_8: JP?#6.1 R?#51.1
DIN_PORT_9: JP?#6.2 R?#52.1
DIN_PORT_10: JP?#6.3 R?#57.1
DIN_PORT_11: JP?#6.4 R?#58.1
DIN_PORT_12: JP?#6.5 R?#63.1
DIN_PORT_13: JP?#6.6 R?#64.1
DIN_PORT_14: JP?#6.7 R?#69.1
DIN_PORT_15: JP?#6.8 R?#70.1
OI_INTA: U?#2.20(INTA) ; port OI_INTA
OI_INTB: U?#2.19(INTB) ; port OI_INTB
OI_RESET: RA?#2.1 U?#2.18(RESET) ; port OI_RESET
NetLED?#11_2: LED?#11.2(K) R?#27.1
NetLED?#12_2: LED?#12.2(K) R?#28.1
NetLED?#13_2: LED?#13.2(K) R?#33.1
NetLED?#14_2: LED?#14.2(K) R?#34.1
NetLED?#15_2: LED?#15.2(K) R?#41.1
NetLED?#16_2: LED?#16.2(K) R?#42.1
NetLED?#17_2: LED?#17.2(K) R?#47.1
NetLED?#18_2: LED?#18.2(K) R?#48.1
NetLED?#19_2: LED?#19.2(K) R?#53.1
NetLED?#20_2: LED?#20.2(K) R?#54.1
NetLED?#21_2: LED?#21.2(K) R?#59.1
NetLED?#22_2: LED?#22.2(K) R?#60.1
NetLED?#23_2: LED?#23.2(K) R?#65.1
NetLED?#24_2: LED?#24.2(K) R?#66.1
NetLED?#25_2: LED?#25.2(K) R?#71.1
NetLED?#26_2: LED?#26.2(K) R?#72.1
NetOP?#11_1: OP?#11.1(A) R?#25.2
NetOP?#12_1: OP?#12.1(A) R?#26.2
NetOP?#13_1: OP?#13.1(A) R?#31.2
NetOP?#14_1: OP?#14.1(A) R?#32.2
NetOP?#15_1: OP?#15.1(A) R?#37.2
NetOP?#16_1: OP?#16.1(A) R?#38.2
NetOP?#17_1: OP?#17.1(A) R?#45.2
NetOP?#18_1: OP?#18.1(A) R?#46.2
NetOP?#19_1: OP?#19.1(A) R?#51.2
NetOP?#20_1: OP?#20.1(A) R?#52.2
NetOP?#21_1: OP?#21.1(A) R?#57.2
NetOP?#22_1: OP?#22.1(A) R?#58.2
NetOP?#23_1: OP?#23.1(A) R?#63.2
NetOP?#24_1: OP?#24.1(A) R?#64.2
NetOP?#25_1: OP?#25.1(A) R?#69.2
NetOP?#26_1: OP?#26.1(A) R?#70.2
NetRA?#2_2: RA?#2.2 U?#2.17(A2)
NetRA?#2_3: RA?#2.3 U?#2.16(A1)
NetRA?#2_4: RA?#2.4 U?#2.15(A0)

Not connected (* = marked no-connect by the designer): U?#2 1(GPB0) 2(GPB1) 3(GPB2) 4(GPB3) 5(GPB4) 6(GPB5) 7(GPB6) 8(GPB7) 11(NC)* 14(NC)*

### Notes on the sheet
- Labels drawn without touching a wire or pin: DIN8, DIN9, DIN10, DIN11, DIN12, DIN13, DIN14, DIN15

### Library data of the parts
JP?#5 JP?#6 = Header 8: 8P Connector; BOM名称: 8P接插件; 版权归属: 源创客; 学习资源: www.ooocke.com
LED?#11-LED?#26 = LED-SMD: Patch LED; BOM名称: 贴片LED; 版权归属: 源创客; 学习资源: www.ooocke.com
R?#25-R?#74 = R: Chip resistor; 版权归属: 源创客; BOM名称: Chip resistor; 学习资源: www.ooocke.com
RA?#2 = R-ARR: 4 way Chip Resistor Array

## Sheet Buzzer.SchDoc
size A4; SheetNumber: 10; SheetTotal: 11
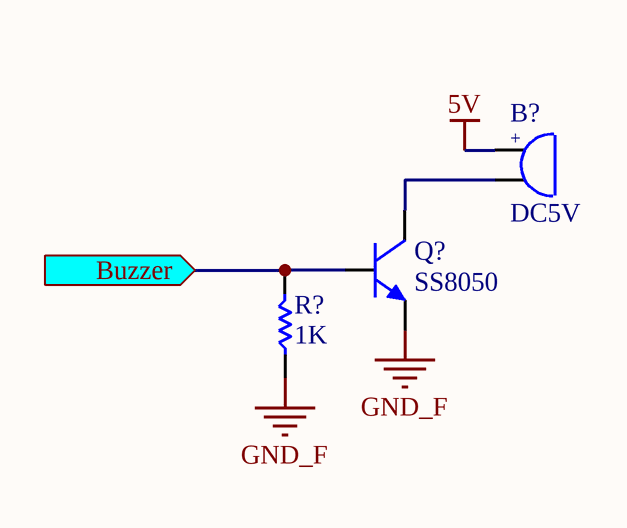
[diagram p10: Buzzer.SchDoc]

### Parts
(Parts that share a designator on the sheet are numbered #1, #2 ... from top to bottom, then left to right.)
B?  DC5V  [Buzzer 5x9x5.5]
Q?  SS8050  [SOT23-3N]
R?#75  1K  [R 0805]

### Ports
Buzzer (in)

### Nets
5V: B?.A  [project net VOUT]
GND_F: Q?.2(E) R?#75.1
BUZZER_TRIG: Q?.1(B) R?#75.2 ; port Buzzer
NetB?_K: B?.K Q?.3(C)

### Notes on the sheet
- (in symbol Buzzer) +

### Library data of the parts
B? = Buzzer: Active Piezo Electronic Buzzer Beep; BOM名称: 蜂鸣器; 版权归属: 源创客; 学习资源: www.ooocke.com
Q? = 8050-SMD: High frequency amplification-NPN; BOM名称: 高频放大-NPN型; 版权归属: 源创客; 属性: 40V 1.5A 1W 100MHZ; 学习资源: www.ooocke.com
R?#75 = R: Chip resistor; 版权归属: 源创客; BOM名称: Chip resistor; 学习资源: www.ooocke.com